# EAGLE schematic MaTouch ESP32-P4 TFT with Touch 7“ V1.2 (EAGLE 6.1)
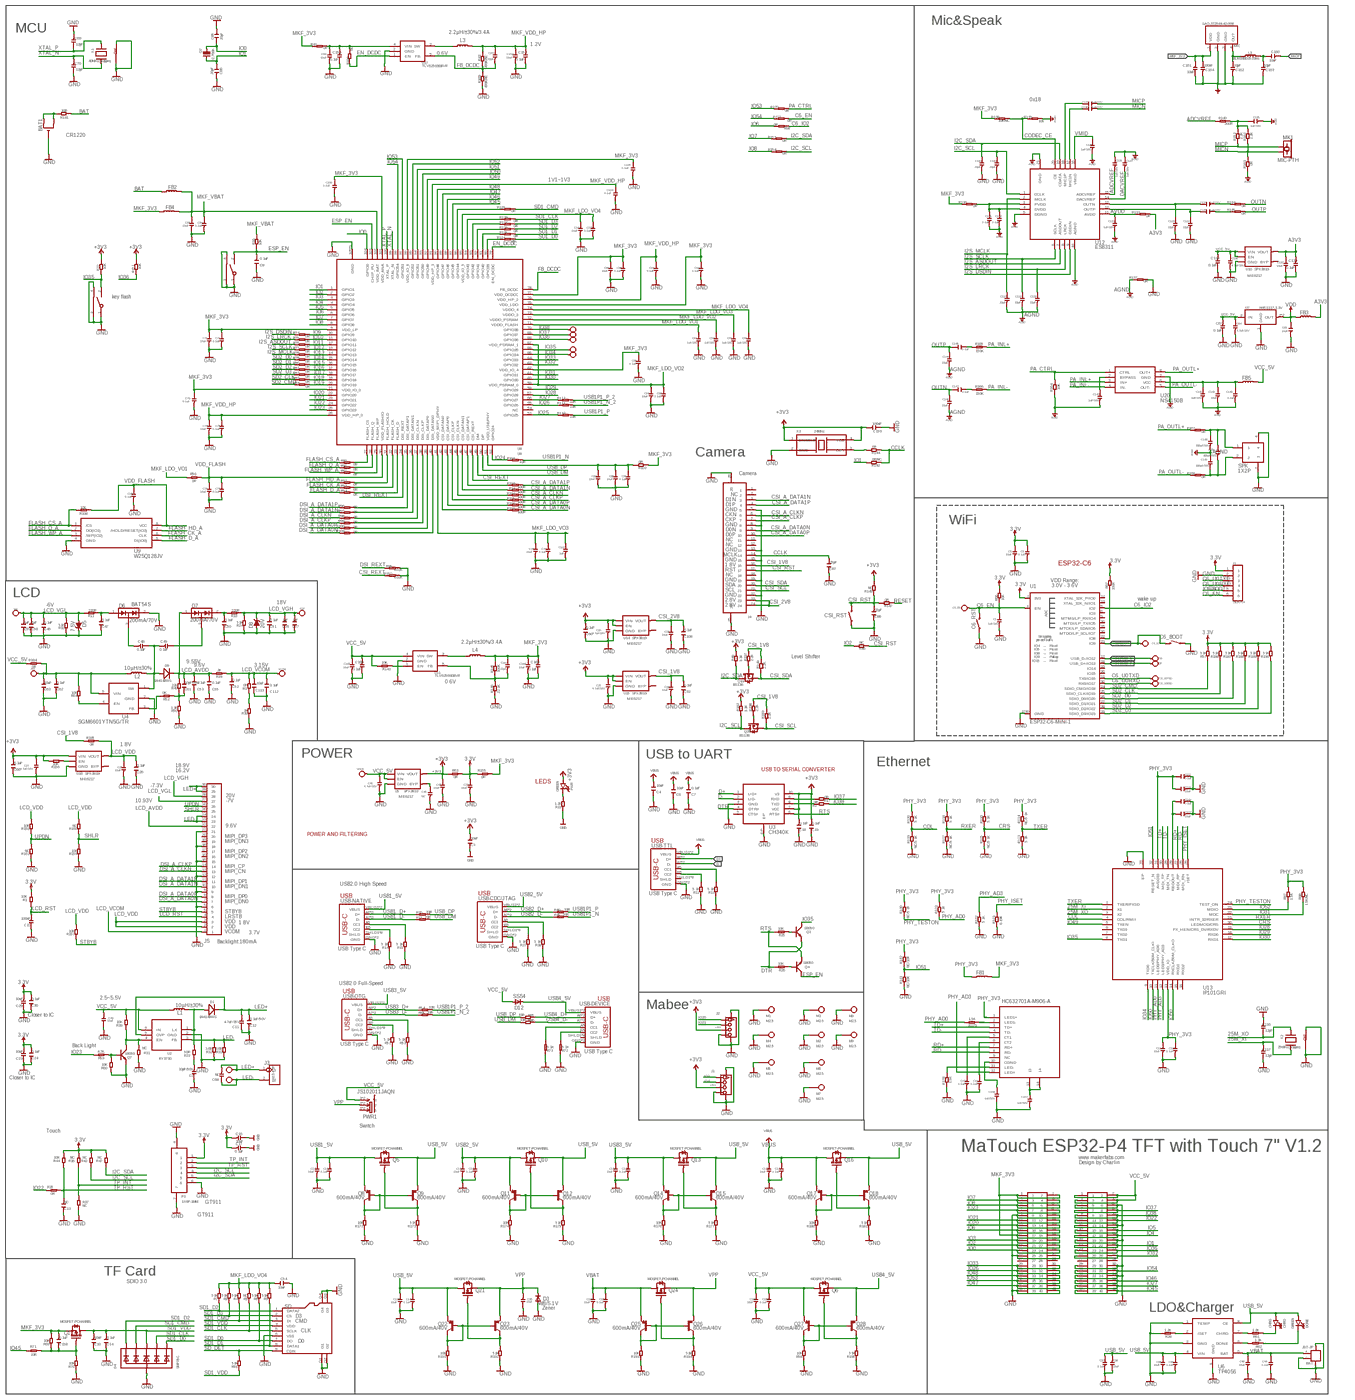
[diagram p0: schematic, sheet 1, overview]
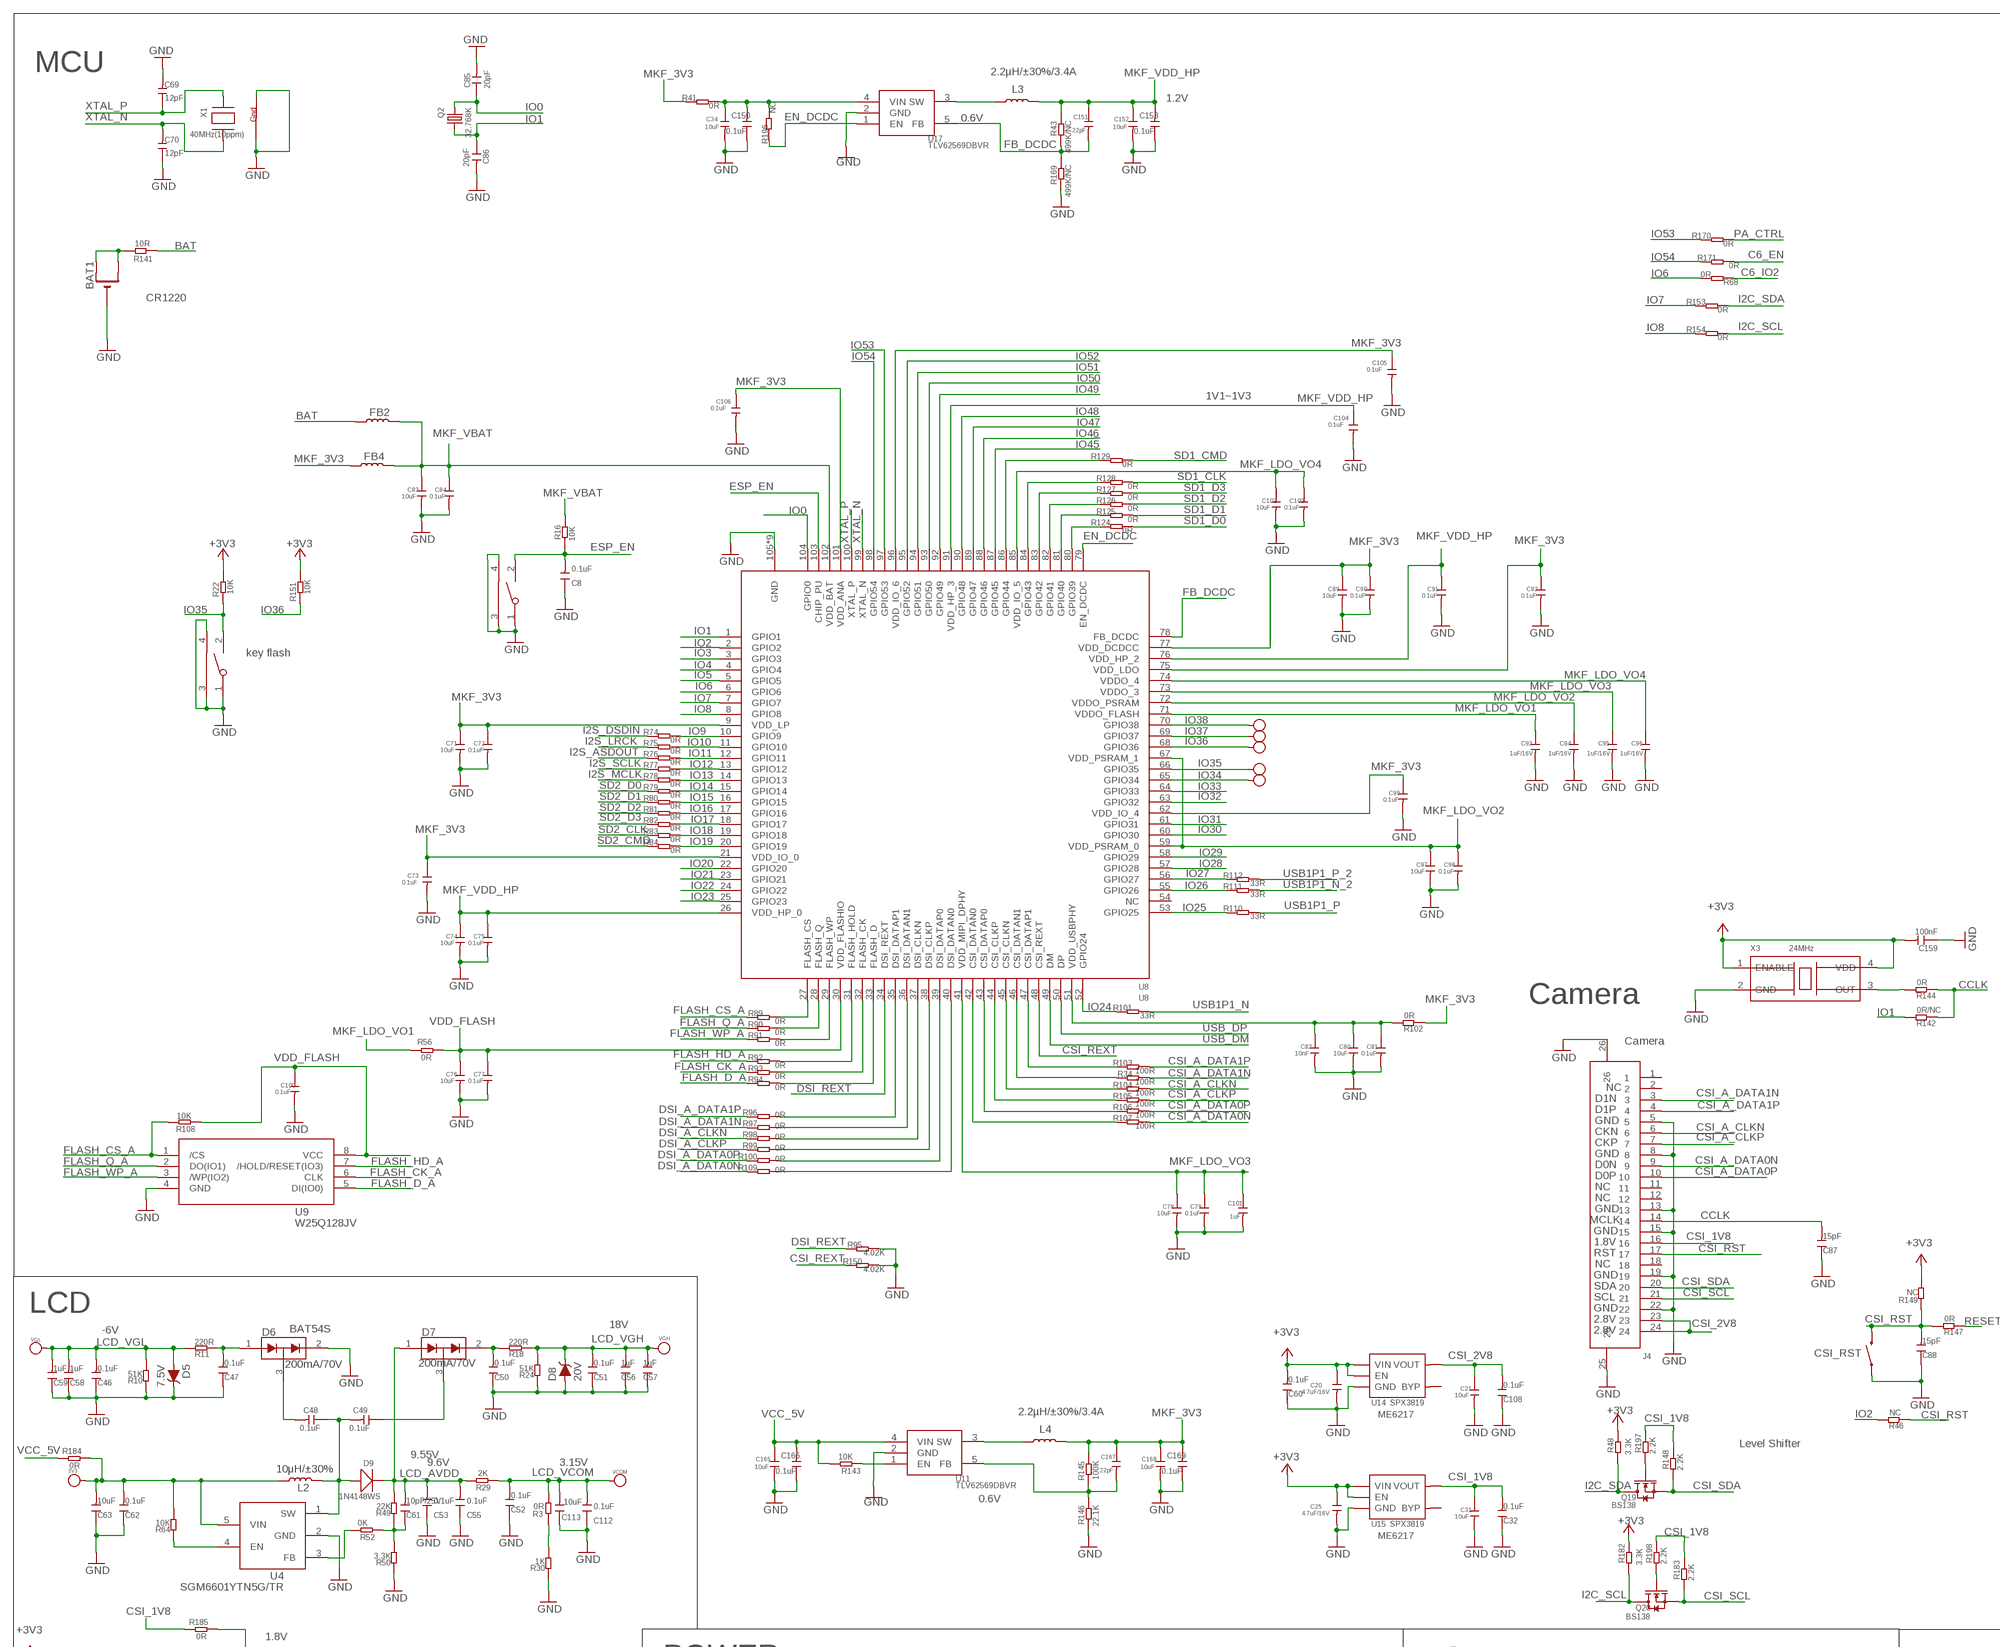
[diagram p1: schematic, sheet 1, part 1 of 4]
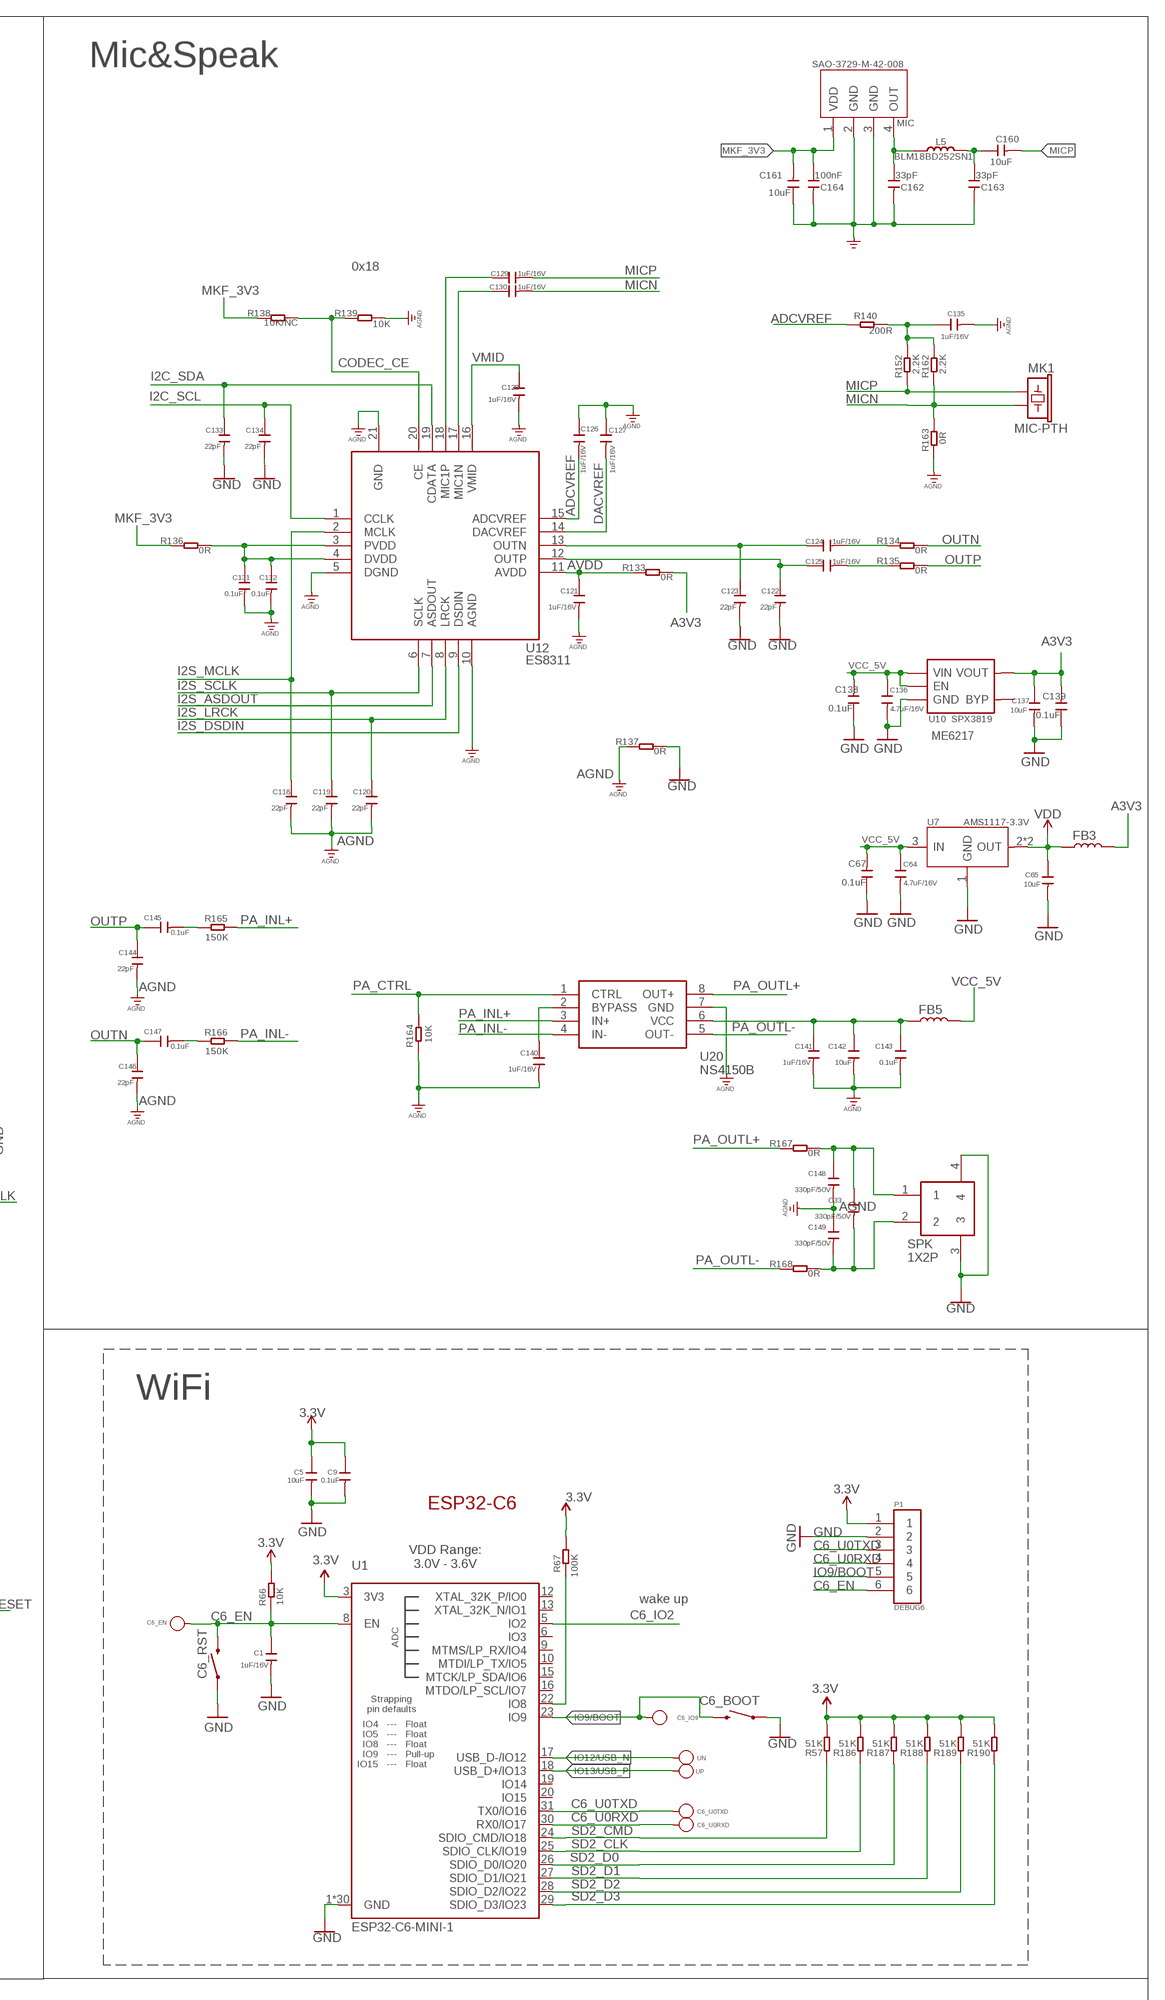
[diagram p2: schematic, sheet 1, part 2 of 4]
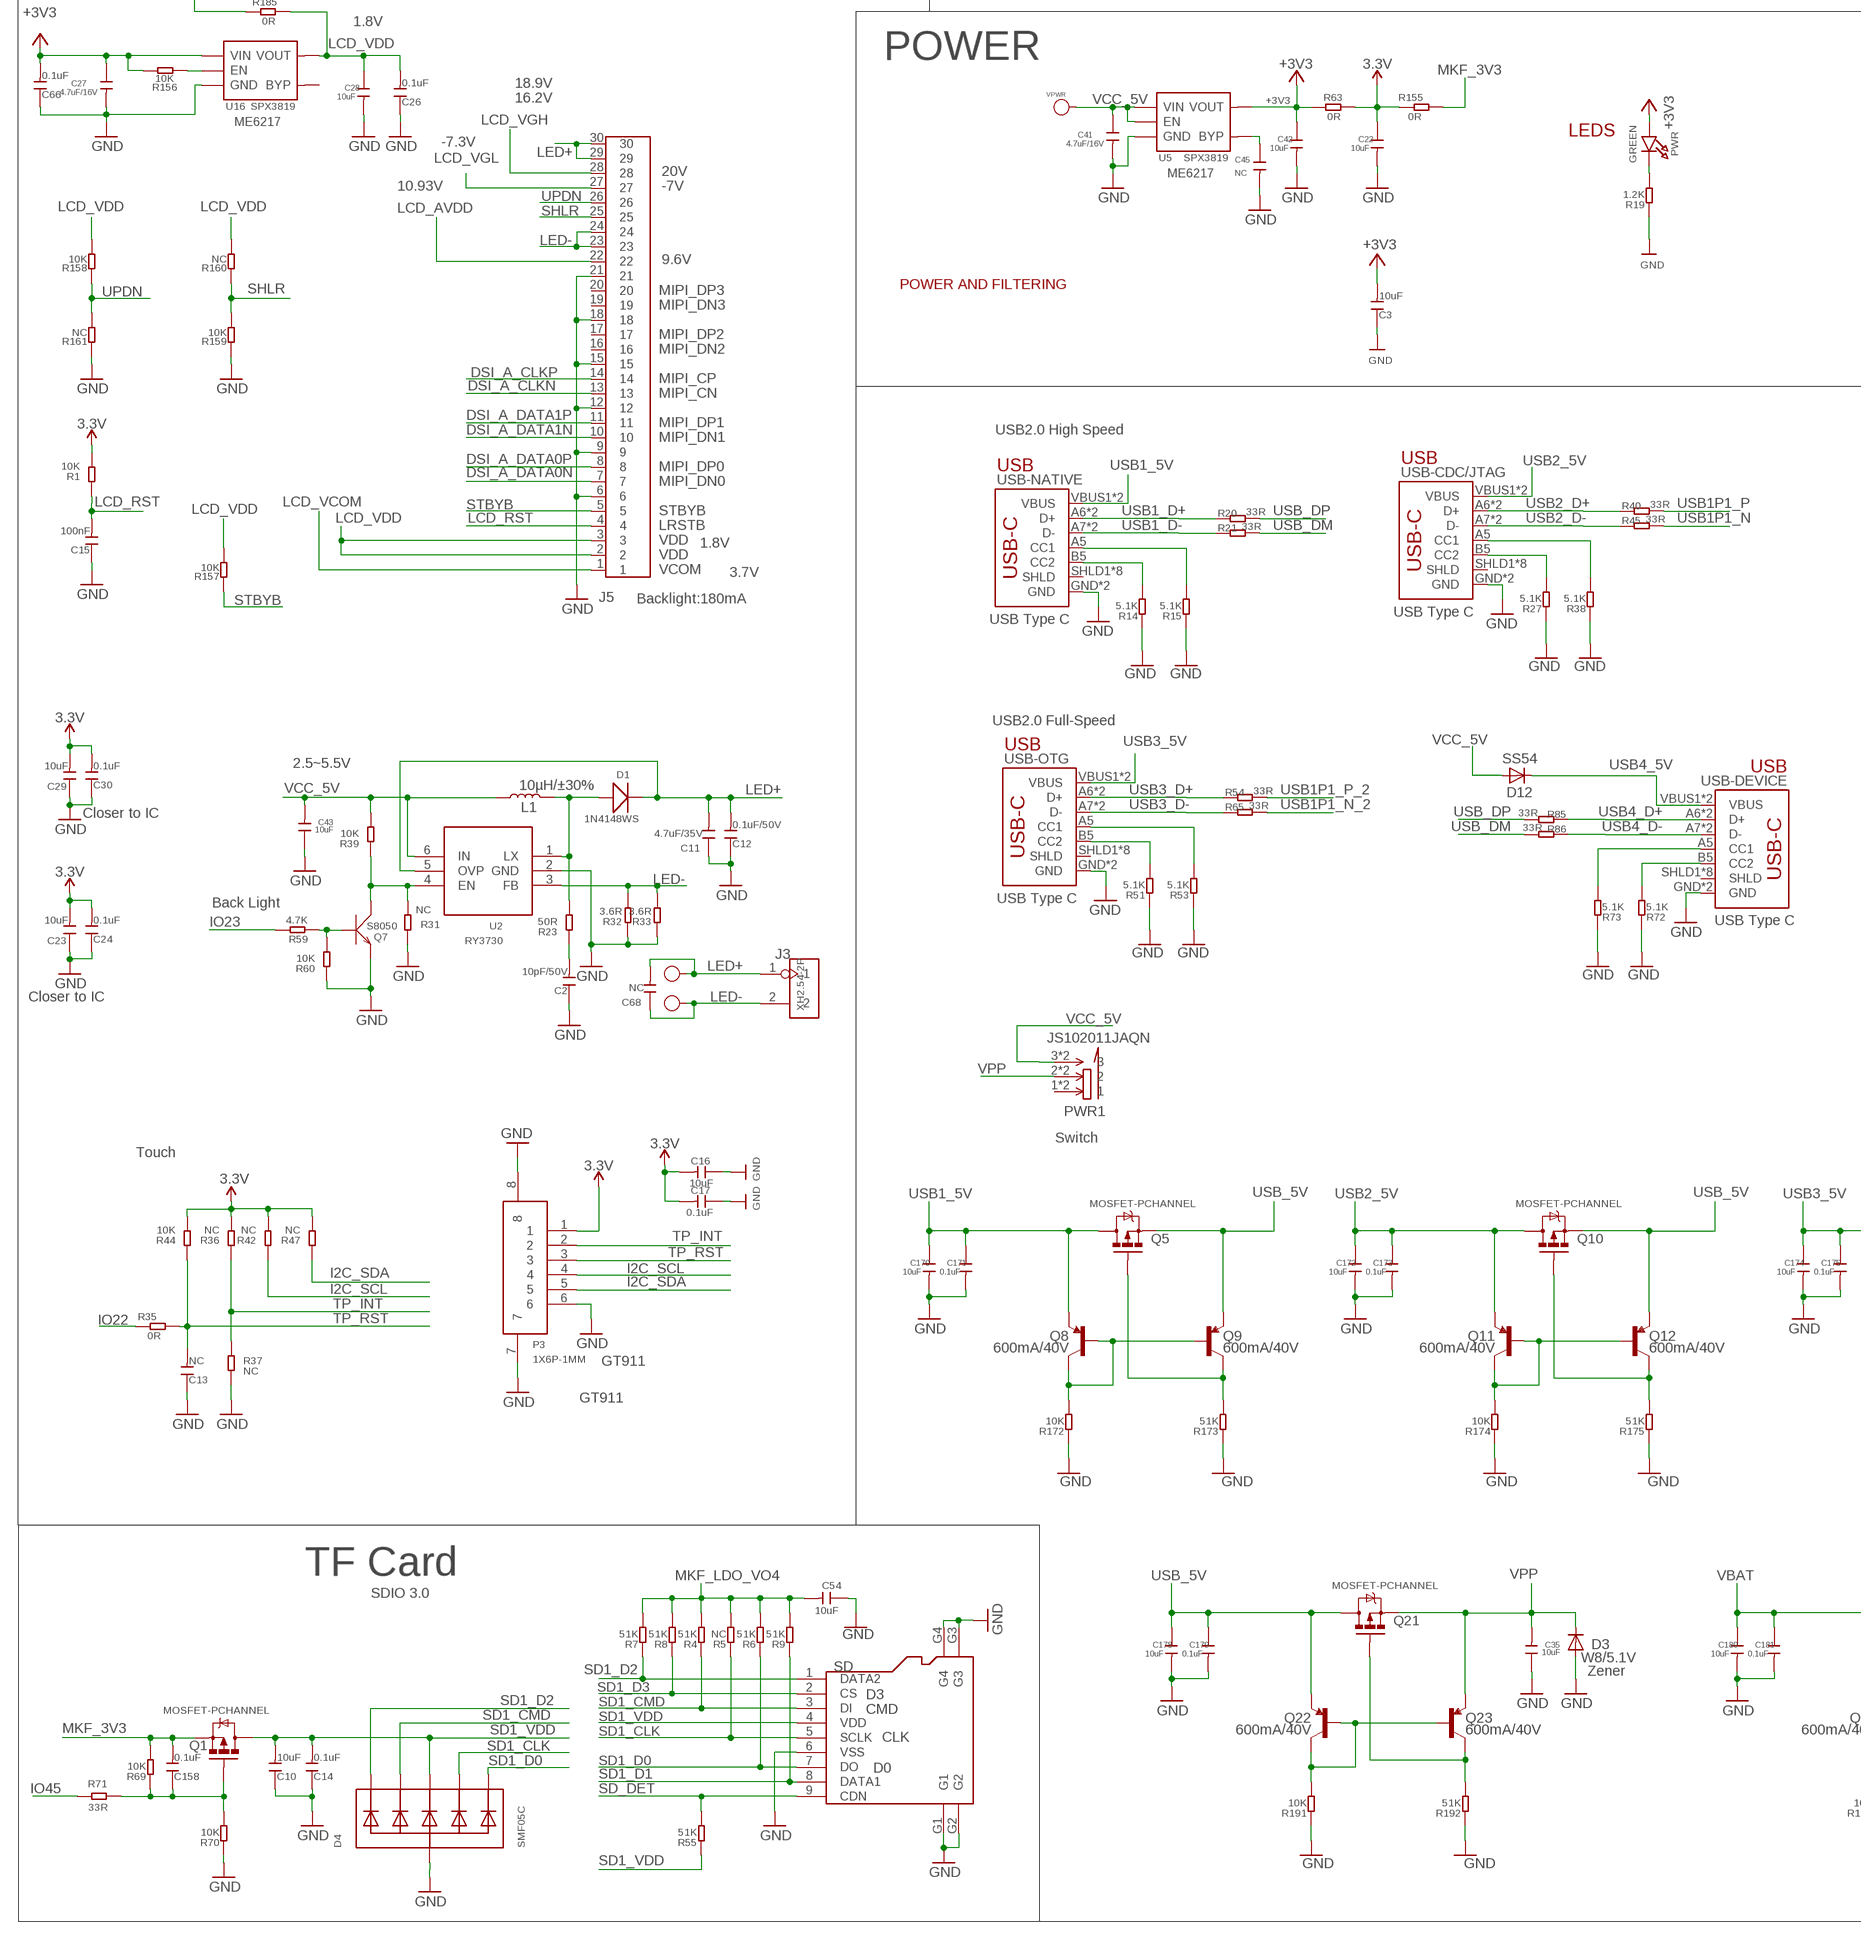
[diagram p3: schematic, sheet 1, part 3 of 4]
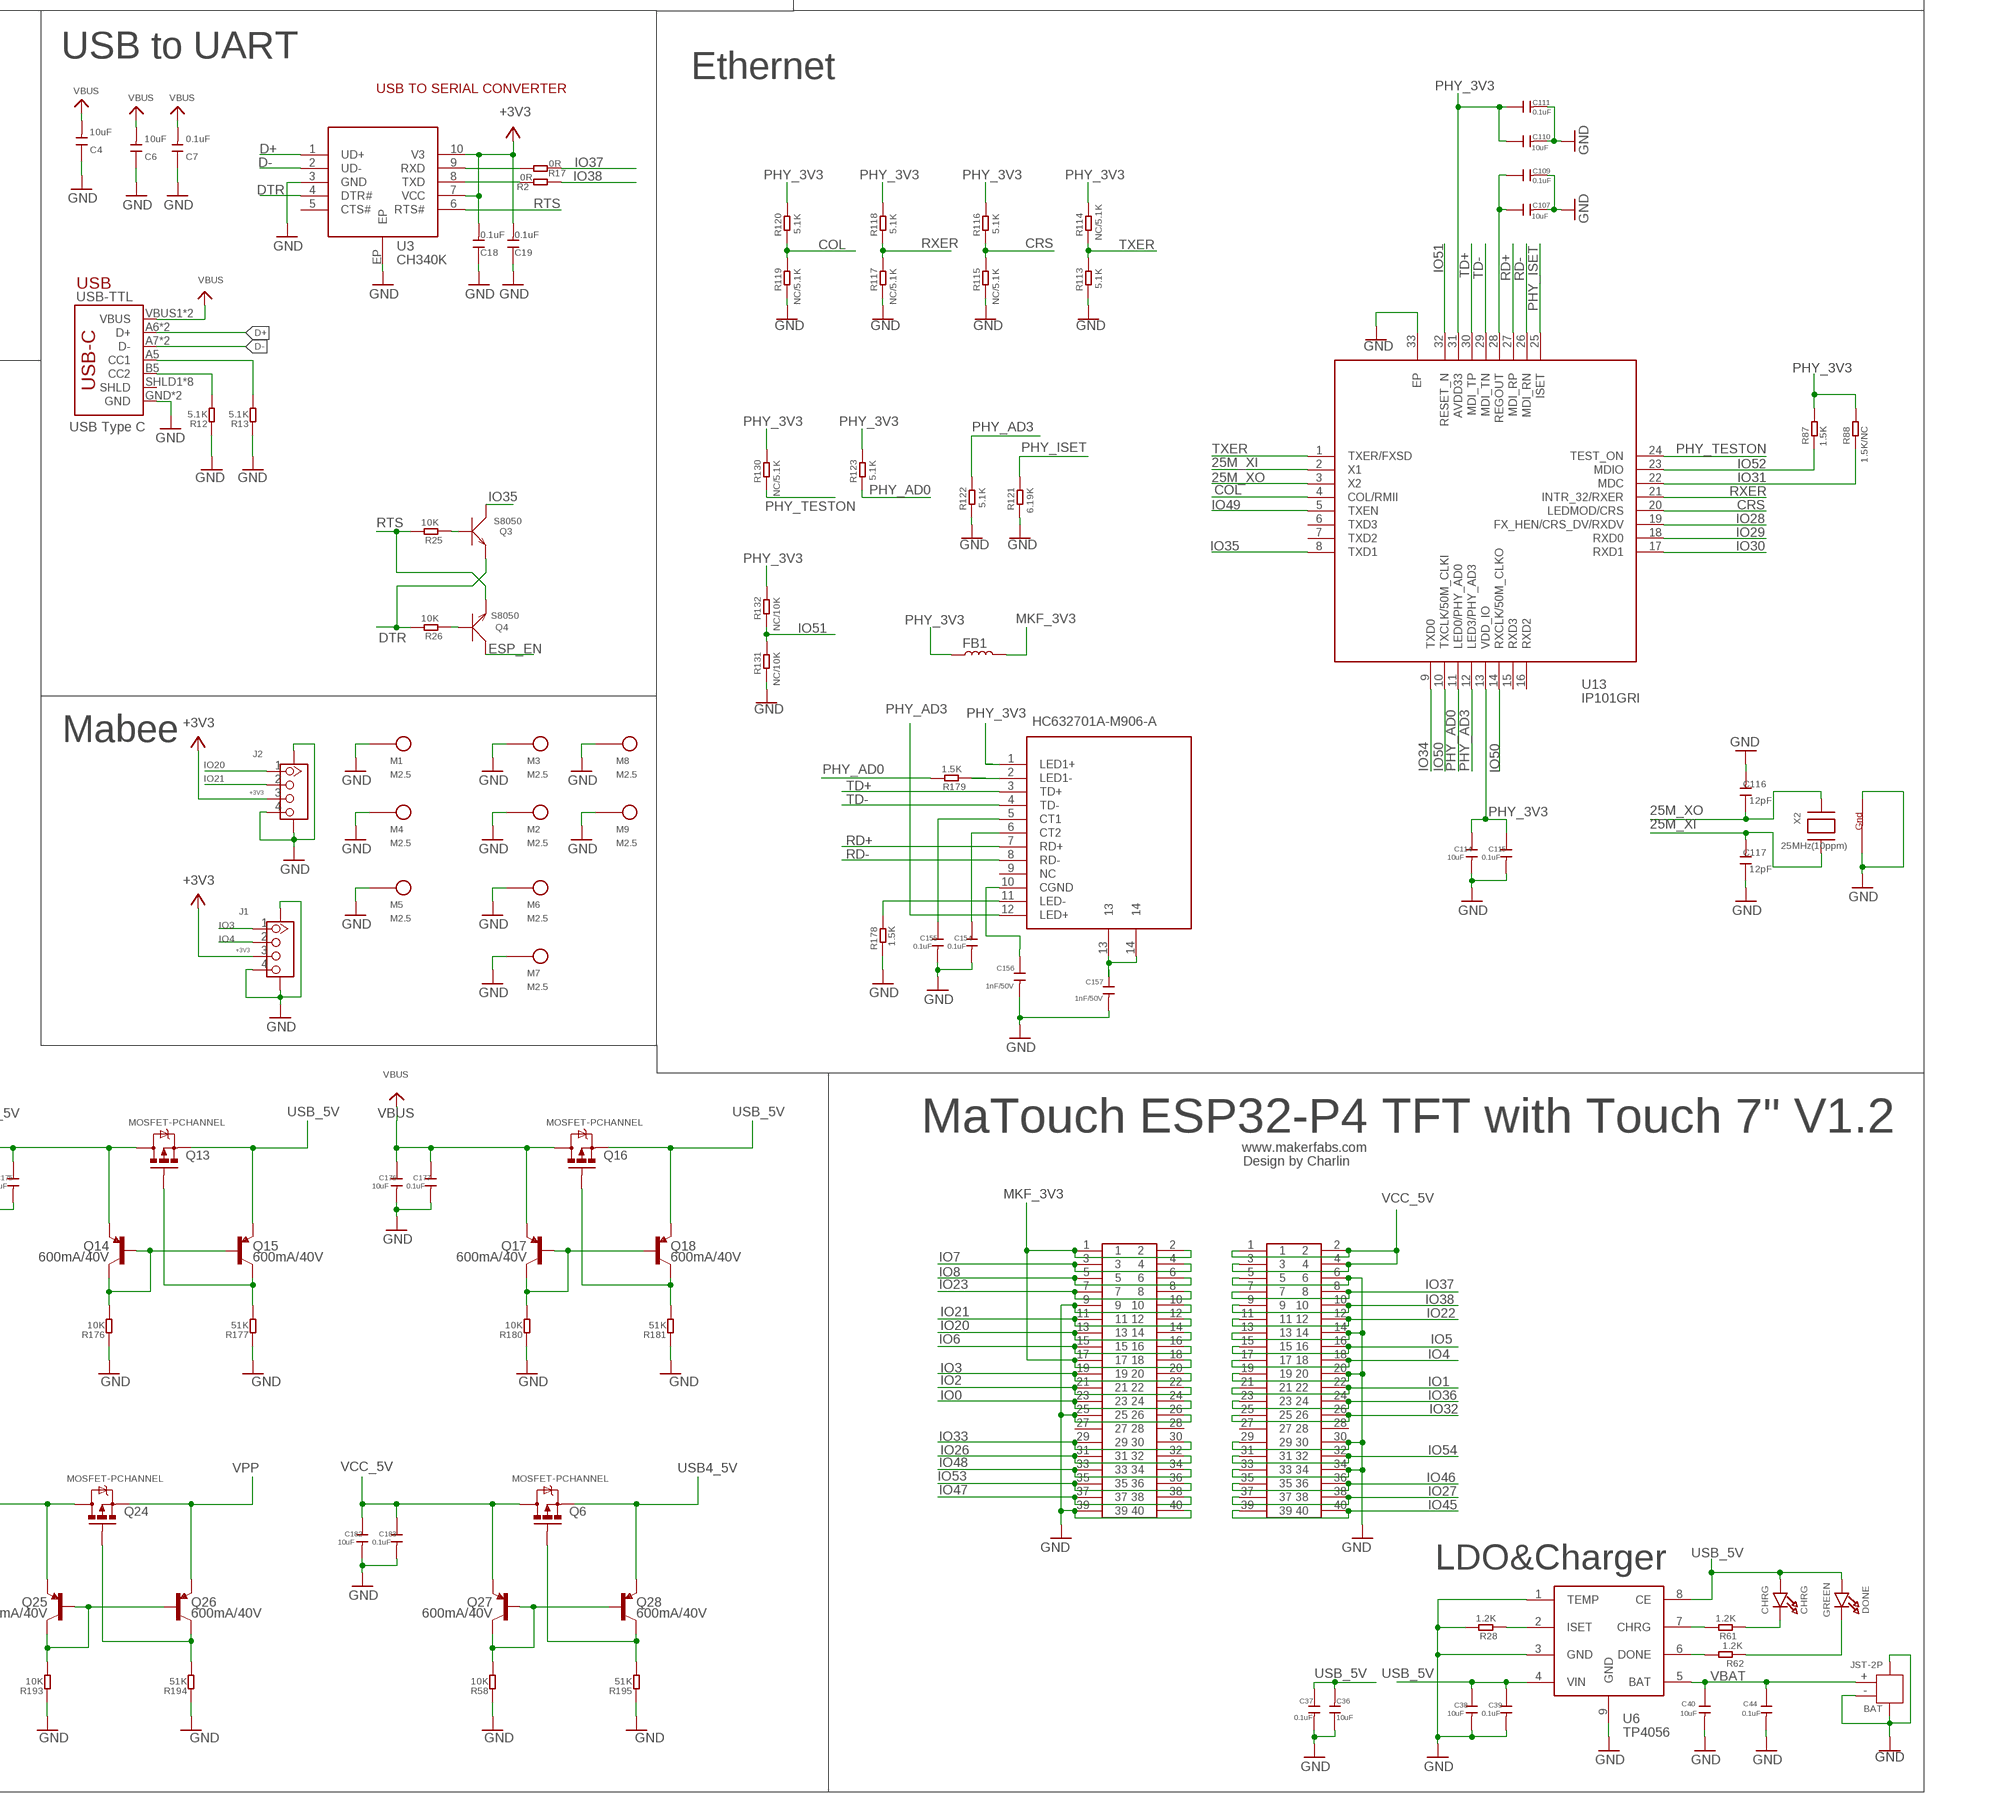
[diagram p4: schematic, sheet 1, part 4 of 4]

## Parts
3V3  PAD-TEST-POINT-CIRCLE'4545'  [TP_4545]
BAT  JST-2P  JST-2P-SMD'2.0'  [HW2-SMD-2.0-90D]
BAT1  CR1220SMT  [CR1220-SMD]
BOOT  TS24CA  [2*4*3.5MM]
C1  1uF/16V  C-0603  [C0603]
C2  10pF/50V  DISCRETE_C-0603  [DISCRETE_C0603]
C3  10uF  DISCRETE_C-0603  [DISCRETE_C0603]
C4  10uF  DISCRETE_C-0603  [DISCRETE_C0603]
C5  10uF  C-0603  [C0603]
C6  10uF  DISCRETE_C-0603  [DISCRETE_C0603]
C6_BOOT  MOMENTARY-SWITCH-SPST-SMD-4.6X2.8MM  [TACTILE_SWITCH_SMD_4.6X2.8MM]
C6_EN  PAD-TEST-POINT-CIRCLE'4545'  [TP_4545]
C6_IO9  PAD-TEST-POINT-CIRCLE'4545'  [TP_4545]
C6_RST  MOMENTARY-SWITCH-SPST-SMD-4.6X2.8MM  [TACTILE_SWITCH_SMD_4.6X2.8MM]
C6_U0RXD  PAD-TEST-POINT-CIRCLE'4545'  [TP_4545]
C6_U0TXD  PAD-TEST-POINT-CIRCLE'4545'  [TP_4545]
C7  0.1uF  DISCRETE_C-0603  [DISCRETE_C0603]
C8  0.1uF  DISCRETE_C-0603  [DISCRETE_C0603]
C9  0.1uF  C-0603  [C0603]
C10  10uF  DISCRETE_C-0603  [DISCRETE_C0603]
C11  4.7uF/35V  DISCRETE_C-1206  [DISCRETE_C1206]
C12  0.1uF/50V  DISCRETE_C-0603  [DISCRETE_C0603]
C13  NC  DISCRETE_C-0603  [DISCRETE_C0603]
C14  0.1uF  DISCRETE_C-0603  [DISCRETE_C0603]
C15  100nF  DISCRETE_C-0603  [DISCRETE_C0603]
C16  10uF  DISCRETE_C-0603  [DISCRETE_C0603]
C17  0.1uF  DISCRETE_C-0603  [DISCRETE_C0603]
C18  0.1uF  DISCRETE_C-0603  [DISCRETE_C0603]
C19  0.1uF  DISCRETE_C-0603  [DISCRETE_C0603]
C20  4.7uF/16V  C-0603  [C0603]
C21  10uF  C-0603  [C0603]
C22  10uF  C-0603  [C0603]
C23  10uF  DISCRETE_C-0603  [DISCRETE_C0603]
C24  0.1uF  DISCRETE_C-0603  [DISCRETE_C0603]
C25  4.7uF/16V  C-0603  [C0603]
C26  0.1uF  DISCRETE_C-0603  [DISCRETE_C0603]
C27  4.7uF/16V  C-0603  [C0603]
C28  10uF  C-0603  [C0603]
C29  10uF  DISCRETE_C-0603  [DISCRETE_C0603]
C30  0.1uF  DISCRETE_C-0603  [DISCRETE_C0603]
C31  10uF  C-0603  [C0603]
C32  0.1uF  DISCRETE_C-0603  [DISCRETE_C0603]
C33  330pF/50V  C-0603  [C0603]
C34  10uF  C-0603  [C0603]
C35  10uF  C-0603  [C0603]
C36  10uF  C-0603  [C0603]
C37  0.1uF  C-0603  [C0603]
C38  10uF  C-0603  [C0603]
C39  0.1uF  C-0603  [C0603]
C40  10uF  C-0603  [C0603]
C41  4.7uF/16V  C-0603  [C0603]
C42  10uF  C-0603  [C0603]
C43  10uF  C-0603  [C0603]
C44  0.1uF  C-0603  [C0603]
C45  NC  C-0603  [C0603]
C46  0.1uF  DISCRETE_C-0603  [DISCRETE_C0603]
C47  0.1uF  DISCRETE_C-0603  [DISCRETE_C0603]
C48  0.1uF  DISCRETE_C-0603  [DISCRETE_C0603]
C49  0.1uF  DISCRETE_C-0603  [DISCRETE_C0603]
C50  0.1uF  DISCRETE_C-0603  [DISCRETE_C0603]
C51  0.1uF  DISCRETE_C-0603  [DISCRETE_C0603]
C52  0.1uF  DISCRETE_C-0603  [DISCRETE_C0603]
C53  0.1uF  DISCRETE_C-0603  [DISCRETE_C0603]
C54  10uF  DISCRETE_C-0603  [DISCRETE_C0603]
C55  0.1uF  DISCRETE_C-0603  [DISCRETE_C0603]
C56  1uF  DISCRETE_C-0603  [DISCRETE_C0603]
C57  1uF  DISCRETE_C-0603  [DISCRETE_C0603]
C58  1uF  DISCRETE_C-0603  [DISCRETE_C0603]
C59  1uF  DISCRETE_C-0603  [DISCRETE_C0603]
C60  0.1uF  DISCRETE_C-0603  [DISCRETE_C0603]
C61  10pF/25V  DISCRETE_C-0603  [DISCRETE_C0603]
C62  0.1uF  DISCRETE_C-0603  [DISCRETE_C0603]
C63  10uF  DISCRETE_C-0603  [DISCRETE_C0603]
C64  4.7uF/16V  C-0603  [C0603]
C65  10uF  C-0603  [C0603]
C66  0.1uF  DISCRETE_C-0603  [DISCRETE_C0603]
C67  0.1uF  C-0603  [C0603]
C68  NC  DISCRETE_C-1206  [DISCRETE_C1206]
C69  12pF  DISCRETE_C-0402  [DISCRETE_C0402]
C70  12pF  DISCRETE_C-0402  [DISCRETE_C0402]
C71  10uF  C-0603  [C0603]
C72  0.1uF  C-0603  [C0603]
C73  0.1uF  C-0603  [C0603]
C74  10uF  C-0603  [C0603]
C75  0.1uF  C-0603  [C0603]
C76  10uF  C-0603  [C0603]
C77  0.1uF  C-0603  [C0603]
C78  10uF  C-0603  [C0603]
C79  0.1uF  C-0603  [C0603]
C80  10uF  C-0603  [C0603]
C81  0.1uF  C-0603  [C0603]
C82  10nF  C-0603  [C0603]
C83  10uF  C-0603  [C0603]
C84  0.1uF  C-0603  [C0603]
C85  20pF  DISCRETE_C-0603  [DISCRETE_C0603]
C86  20pF  DISCRETE_C-0603  [DISCRETE_C0603]
C87  15pF  DISCRETE_C-0603  [DISCRETE_C0603]
C88  15pF  DISCRETE_C-0603  [DISCRETE_C0603]
C89  10uF  C-0603  [C0603]
C90  0.1uF  C-0603  [C0603]
C91  0.1uF  C-0603  [C0603]
C92  0.1uF  C-0603  [C0603]
C93  1uF/16V  C-0603  [C0603]
C94  1uF/16V  C-0603  [C0603]
C95  1uF/16V  C-0603  [C0603]
C96  1uF/16V  C-0603  [C0603]
C97  10uF  C-0603  [C0603]
C98  0.1uF  C-0603  [C0603]
C99  0.1uF  C-0603  [C0603]
C100  0.1uF  C-0603  [C0603]
C101  1uF  C-0603  [C0603]
C102  10uF  C-0603  [C0603]
C103  0.1uF  C-0603  [C0603]
C104  0.1uF  C-0603  [C0603]
C105  0.1uF  C-0603  [C0603]
C106  0.1uF  C-0603  [C0603]
C107  10uF  C-0603  [C0603]
C108  0.1uF  DISCRETE_C-0603  [DISCRETE_C0603]
C109  0.1uF  C-0603  [C0603]
C110  10uF  C-0603  [C0603]
C111  0.1uF  C-0603  [C0603]
C112  0.1uF  DISCRETE_C-0603  [DISCRETE_C0603]
C113  10uF  DISCRETE_C-0603  [DISCRETE_C0603]
C114  10uF  C-0603  [C0603]
C115  0.1uF  C-0603  [C0603]
C116  12pF  DISCRETE_C-0402  [DISCRETE_C0402]
C117  12pF  DISCRETE_C-0402  [DISCRETE_C0402]
C118  22pF  C-0603  [C0603]
C119  22pF  C-0603  [C0603]
C120  22pF  C-0603  [C0603]
C121  1uF/16V  C-0603  [C0603]
C122  22pF  C-0603  [C0603]
C123  22pF  C-0603  [C0603]
C124  1uF/16V  C-0603  [C0603]
C125  1uF/16V  C-0603  [C0603]
C126  1uF/16V  C-0603  [C0603]
C127  1uF/16V  C-0603  [C0603]
C128  1uF/16V  C-0603  [C0603]
C129  1uF/16V  C-0603  [C0603]
C130  1uF/16V  C-0603  [C0603]
C131  0.1uF  C-0603  [C0603]
C132  0.1uF  C-0603  [C0603]
C133  22pF  C-0603  [C0603]
C134  22pF  C-0603  [C0603]
C135  1uF/16V  C-0603  [C0603]
C136  4.7uF/16V  C-0603  [C0603]
C137  10uF  C-0603  [C0603]
C138  0.1uF  C-0603  [C0603]
C139  0.1uF  C-0603  [C0603]
C140  1uF/16V  C-0603  [C0603]
C141  1uF/16V  C-0603  [C0603]
C142  10uF  C-0603  [C0603]
C143  0.1uF  C-0603  [C0603]
C144  22pF  C-0603  [C0603]
C145  0.1uF  C-0603  [C0603]
C146  22pF  C-0603  [C0603]
C147  0.1uF  C-0603  [C0603]
C148  330pF/50V  C-0603  [C0603]
C149  330pF/50V  C-0603  [C0603]
C150  0.1uF  C-0603  [C0603]
C151  22pF  C-0603  [C0603]
C152  10uF  C-0603  [C0603]
C153  0.1uF  C-0603  [C0603]
C154  0.1uF  C-0603  [C0603]
C155  0.1uF  C-0603  [C0603]
C156  1nF/50V  C-0603  [C0603]
C157  1nF/50V  C-0603  [C0603]
C158  0.1uF  DISCRETE_C-0603  [DISCRETE_C0603]
C159  100nF  CAP-0402  [C0402]
C160  10uF  CAP-0603  [C0603]
C161  10uF  CAP-0603  [C0603]
C162  33pF  CAP-0603  [C0603]
C163  33pF  CAP-0603  [C0603]
C164  100nF  CAP-0603  [C0603]
C165  10uF  C-0603  [C0603]
C166  0.1uF  C-0603  [C0603]
C167  22pF  C-0603  [C0603]
C168  10uF  C-0603  [C0603]
C169  0.1uF  C-0603  [C0603]
C170  10uF  C-0603  [C0603]
C171  0.1uF  C-0603  [C0603]
C172  10uF  C-0603  [C0603]
C173  0.1uF  C-0603  [C0603]
C174  10uF  C-0603  [C0603]
C175  0.1uF  C-0603  [C0603]
C176  10uF  C-0603  [C0603]
C177  0.1uF  C-0603  [C0603]
C178  10uF  C-0603  [C0603]
C179  0.1uF  C-0603  [C0603]
C180  10uF  C-0603  [C0603]
C181  0.1uF  C-0603  [C0603]
C182  10uF  C-0603  [C0603]
C183  0.1uF  C-0603  [C0603]
CHRG  CHRG  LED0805_NOOUTLINE  [CHIPLED_0805_NOOUTLINE]
CSI_RST  MOMENTARY-SWITCH-SPST-SMD-4.6X2.8MM  [TACTILE_SWITCH_SMD_4.6X2.8MM]
D1  1N4148WS  D'0805'  [SOD323]
D3  W8/5.1V  DIODE-SOD123  [SOD123]
D4  SMF05C  TVSARRAY_5LANE  [SOT363]
D5  7.5V  DIODE-ZENER-MMSZ5232BS  [SOD-323]
D6  200mA/70V  BAV99  [SOT23-3]
D7  200mA/70V  BAV99  [SOT23-3]
D8  20V  DIODE-ZENER-MMSZ5232BS  [SOD-323]
D9  1N4148WS  D'0805'  [SOD323]
D12  SS54  DIODE-DO-214AC  [DO-214AC]
D+  TEST-POINT'4545'  [TP-D45MIL]
D-  TEST-POINT'4545'  [TP-D45MIL]
DONE  GREEN  LED0805_NOOUTLINE  [CHIPLED_0805_NOOUTLINE]
FB1  INDUCTORFB-30OHM  [0603]
FB2  INDUCTORFB-30OHM  [0603]
FB3  INDUCTORFB-30OHM  [0603]
FB4  INDUCTORFB-30OHM  [0603]
FB5  INDUCTORFB-30OHM  [0603]
IO34  TEST-POINT'4545'  [TP-D45MIL]
IO35  TEST-POINT'4545'  [TP-D45MIL]
IO36  TEST-POINT'4545'  [TP-D45MIL]
IO37  TEST-POINT'4545'  [TP-D45MIL]
IO38  TEST-POINT'4545'  [TP-D45MIL]
J1  GROVE-CONNECTOR-SMD'90D'  [HW4-SMD-2.0-90D]
J2  GROVE-CONNECTOR-SMD'90D'  [HW4-SMD-2.0-90D]
J3  XH2.54-2P  [XH2.54-2P]
J4  FPC-24P  [SMD26-50P-1760L450W]
J5  FPC-SOCKET-0.5-30P  [30P-0.5-90D-18.4X5.0]
J6  CON2X20-254P-A  [SMD2X20-254P-5080L750W920H]
J7  HR961160C  [HR961160C]
J10  CON2X20-254P-A  [SMD2X20-254P-5080L750W920H]
L1  10µH/±30%  INDUCTOR-CR54-3.3UH  [CR54]
L2  10µH/±30%  INDUCTOR-CR54-3.3UH  [CR54]
L3  2.2µH/±30%/3.4A  INDUCTOR-CR54-3.3UH  [CR54]
L4  2.2µH/±30%/3.4A  INDUCTOR-CR54-3.3UH  [CR54]
L5  BLM18BD252SN1  INDUCTOR/FERRITE-BEAD'0603'  [L0603]
M1  M2.5  [M2.5]
M2  M2.5  [M2.5]
M3  M2.5  [M2.5]
M4  M2.5  [M2.5]
M5  M2.5  [M2.5]
M6  M2.5  [M2.5]
M7  M2.5  [M2.5]
M8  M2.5  [M2.5]
M9  M2.5  [M2.5]
MIC  SAO-3729-M-42-008  MIC-MSM421A3729H8-C  [MIC4-SMD-3.76X2.95MM]
MK1  MIC-PTH  [MICROPHONE-PTH-9.7MM]
P1  DEBUG6  [DEBUG*6]
P3  1X6P-1MM  [1*6P-SMT1MM]
PWR  GREEN  LED0805_NOOUTLINE  [CHIPLED_0805_NOOUTLINE]
PWR1  JS102011JAQN  [SMD-6-2.5MM]
Q1  MOSFET-PCHANNEL  [SOT23-3]
Q2  32.768K  CRYSTAL_3215  [XTAL3215]
Q3  S8050  TRANSISTOR-NPN-SOT23  [SOT23]
Q4  S8050  TRANSISTOR-NPN-SOT23  [SOT23]
Q5  MOSFET-PCHANNEL  [SOT23-3]
Q6  MOSFET-PCHANNEL  [SOT23-3]
Q7  S8050  TRANSISTOR-NPN-SOT23  [SOT23]
Q8  600mA/40V  TRANS_PNP-MMBT4403  [SOT23-3]
Q9  600mA/40V  TRANS_PNP-MMBT4403  [SOT23-3]
Q10  MOSFET-PCHANNEL  [SOT23-3]
Q11  600mA/40V  TRANS_PNP-MMBT4403  [SOT23-3]
Q12  600mA/40V  TRANS_PNP-MMBT4403  [SOT23-3]
Q13  MOSFET-PCHANNEL  [SOT23-3]
Q14  600mA/40V  TRANS_PNP-MMBT4403  [SOT23-3]
Q15  600mA/40V  TRANS_PNP-MMBT4403  [SOT23-3]
Q16  MOSFET-PCHANNEL  [SOT23-3]
Q17  600mA/40V  TRANS_PNP-MMBT4403  [SOT23-3]
Q18  600mA/40V  TRANS_PNP-MMBT4403  [SOT23-3]
Q19  BS138  MOSFET-N'SOT23'  [SOT23]
Q20  BS138  MOSFET-N'SOT23'  [SOT23]
Q21  MOSFET-PCHANNEL  [SOT23-3]
Q22  600mA/40V  TRANS_PNP-MMBT4403  [SOT23-3]
Q23  600mA/40V  TRANS_PNP-MMBT4403  [SOT23-3]
Q24  MOSFET-PCHANNEL  [SOT23-3]
Q25  600mA/40V  TRANS_PNP-MMBT4403  [SOT23-3]
Q26  600mA/40V  TRANS_PNP-MMBT4403  [SOT23-3]
Q27  600mA/40V  TRANS_PNP-MMBT4403  [SOT23-3]
Q28  600mA/40V  TRANS_PNP-MMBT4403  [SOT23-3]
R1  10K  DISCRETE_R-0603  [DISCRETE_R0603]
R2  0R  R-0603  [R0603]
R3  0R  DISCRETE_R-0603  [DISCRETE_R0603]
R4  51K  DISCRETE_R-0603  [DISCRETE_R0603]
R5  NC  DISCRETE_R-0603  [DISCRETE_R0603]
R6  51K  DISCRETE_R-0603  [DISCRETE_R0603]
R7  51K  DISCRETE_R-0603  [DISCRETE_R0603]
R8  51K  DISCRETE_R-0603  [DISCRETE_R0603]
R9  51K  DISCRETE_R-0603  [DISCRETE_R0603]
R10  51K  DISCRETE_R-0603  [DISCRETE_R0603]
R11  220R  DISCRETE_R-0603  [DISCRETE_R0603]
R12  5.1K  DISCRETE_R-0603  [DISCRETE_R0603]
R13  5.1K  DISCRETE_R-0603  [DISCRETE_R0603]
R14  5.1K  DISCRETE_R-0603  [DISCRETE_R0603]
R15  5.1K  DISCRETE_R-0603  [DISCRETE_R0603]
R16  10K  R-0603  [R0603]
R17  0R  R-0603  [R0603]
R18  220R  DISCRETE_R-0603  [DISCRETE_R0603]
R19  1.2K  DISCRETE_R-0603  [DISCRETE_R0603]
R20  33R  R-0603  [R0603]
R21  33R  R-0603  [R0603]
R22  10K  R-0603  [R0603]
R23  50R  DISCRETE_R-0603  [DISCRETE_R0603]
R24  51K  DISCRETE_R-0603  [DISCRETE_R0603]
R25  10K  R-0603  [R0603]
R26  10K  R-0603  [R0603]
R27  5.1K  DISCRETE_R-0603  [DISCRETE_R0603]
R28  1.2K  R-0603  [R0603]
R29  2K  DISCRETE_R-0603  [DISCRETE_R0603]
R30  1K  DISCRETE_R-0603  [DISCRETE_R0603]
R31  NC  DISCRETE_R-0603  [DISCRETE_R0603]
R32  3.6R  DISCRETE_R-0603  [DISCRETE_R0603]
R33  3.6R  DISCRETE_R-0603  [DISCRETE_R0603]
R34  100R  R-0603  [R0603]
R35  0R  R-0603  [R0603]
R36  NC  DISCRETE_R-0603  [DISCRETE_R0603]
R37  NC  DISCRETE_R-0603  [DISCRETE_R0603]
R38  5.1K  DISCRETE_R-0603  [DISCRETE_R0603]
R39  10K  DISCRETE_R-0603  [DISCRETE_R0603]
R40  33R  R-0603  [R0603]
R41  0R  R-0603  [R0603]
R42  NC  DISCRETE_R-0603  [DISCRETE_R0603]
R43  499K/NC  R-0603  [R0603]
R44  10K  DISCRETE_R-0603  [DISCRETE_R0603]
R45  33R  R-0603  [R0603]
R46  NC  R-0603  [R0603]
R47  NC  DISCRETE_R-0603  [DISCRETE_R0603]
R48  3.3K  R-0603  [R0603]
R49  22K  DISCRETE_R-0603  [DISCRETE_R0603]
R50  3.3K  DISCRETE_R-0603  [DISCRETE_R0603]
R51  5.1K  DISCRETE_R-0603  [DISCRETE_R0603]
R52  0K  DISCRETE_R-0603  [DISCRETE_R0603]
R53  5.1K  DISCRETE_R-0603  [DISCRETE_R0603]
R54  33R  R-0603  [R0603]
R55  51K  DISCRETE_R-0603  [DISCRETE_R0603]
R56  0R  R-0603  [R0603]
R57  51K  DISCRETE_R-0603  [DISCRETE_R0603]
R58  10K  DISCRETE_R-0603  [DISCRETE_R0603]
R59  4.7K  DISCRETE_R-0603  [DISCRETE_R0603]
R60  10K  DISCRETE_R-0603  [DISCRETE_R0603]
R61  1.2K  R-0603  [R0603]
R62  1.2K  R-0603  [R0603]
R63  0R  R-0603  [R0603]
R64  10K  DISCRETE_R-0603  [DISCRETE_R0603]
R65  33R  R-0603  [R0603]
R66  10K  R-0603  [R0603]
R67  100K  R-0603  [R0603]
R68  0R  R-0603  [R0603]
R69  10K  DISCRETE_R-0603  [DISCRETE_R0603]
R70  10K  DISCRETE_R-0603  [DISCRETE_R0603]
R71  33R  R-0603  [R0603]
R72  5.1K  DISCRETE_R-0603  [DISCRETE_R0603]
R73  5.1K  DISCRETE_R-0603  [DISCRETE_R0603]
R74  0R  R-0603  [R0603]
R75  0R  R-0603  [R0603]
R76  0R  R-0603  [R0603]
R77  0R  R-0603  [R0603]
R78  0R  R-0603  [R0603]
R79  0R  R-0603  [R0603]
R80  0R  R-0603  [R0603]
R81  0R  R-0603  [R0603]
R82  0R  R-0603  [R0603]
R83  0R  R-0603  [R0603]
R84  0R  R-0603  [R0603]
R85  33R  R-0603  [R0603]
R86  33R  R-0603  [R0603]
R87  1.5K  R-0603  [R0603]
R88  1.5K/NC  R-0603  [R0603]
R89  0R  R-0603  [R0603]
R90  0R  R-0603  [R0603]
R91  0R  R-0603  [R0603]
R92  0R  R-0603  [R0603]
R93  0R  R-0603  [R0603]
R94  0R  R-0603  [R0603]
R95  4.02K  R-0603  [R0603]
R96  0R  R-0603  [R0603]
R97  0R  R-0603  [R0603]
R98  0R  R-0603  [R0603]
R99  0R  R-0603  [R0603]
R100  0R  R-0603  [R0603]
R101  33R  R-0603  [R0603]
R102  0R  R-0603  [R0603]
R103  100R  R-0603  [R0603]
R104  100R  R-0603  [R0603]
R105  100R  R-0603  [R0603]
R106  100R  R-0603  [R0603]
R107  100R  R-0603  [R0603]
R108  10K  DISCRETE_R-0603  [DISCRETE_R0603]
R109  0R  R-0603  [R0603]
R110  33R  R-0603  [R0603]
R111  33R  R-0603  [R0603]
R112  33R  R-0603  [R0603]
R113  5.1K  R-0603  [R0603]
R114  NC/5.1K  R-0603  [R0603]
R115  NC/5.1K  R-0603  [R0603]
R116  5.1K  R-0603  [R0603]
R117  NC/5.1K  R-0603  [R0603]
R118  5.1K  R-0603  [R0603]
R119  NC/5.1K  R-0603  [R0603]
R120  5.1K  R-0603  [R0603]
R121  6.19K  R-0603  [R0603]
R122  5.1K  R-0603  [R0603]
R123  5.1K  R-0603  [R0603]
R124  0R  R-0603  [R0603]
R125  0R  R-0603  [R0603]
R126  0R  R-0603  [R0603]
R127  0R  R-0603  [R0603]
R128  0R  R-0603  [R0603]
R129  0R  R-0603  [R0603]
R130  NC/5.1K  R-0603  [R0603]
R131  NC/10K  R-0603  [R0603]
R132  NC/10K  R-0603  [R0603]
R133  0R  R-0603  [R0603]
R134  0R  R-0603  [R0603]
R135  0R  R-0603  [R0603]
R136  0R  R-0603  [R0603]
R137  0R  R-0603  [R0603]
R138  10K/NC  R-0603  [R0603]
R139  10K  R-0603  [R0603]
R140  200R  R-0603  [R0603]
R141  10R  R-0603  [R0603]
R142  0R/NC  R-0603  [R0603]
R143  10K  R-0603  [R0603]
R144  0R  R-0603  [R0603]
R145  100K  R-0603  [R0603]
R146  22.1K  R-0603  [R0603]
R147  0R  R-0603  [R0603]
R148  2.2K  R-0603  [R0603]
R149  NC  DISCRETE_R-0603  [DISCRETE_R0603]
R150  4.02K  R-0603  [R0603]
R151  10K  R-0603  [R0603]
R152  2.2K  R-0603  [R0603]
R153  0R  R-0603  [R0603]
R154  0R  R-0603  [R0603]
R155  0R  R-0603  [R0603]
R156  10K  DISCRETE_R-0603  [DISCRETE_R0603]
R157  10K  DISCRETE_R-0603  [DISCRETE_R0603]
R158  10K  DISCRETE_R-0603  [DISCRETE_R0603]
R159  10K  DISCRETE_R-0603  [DISCRETE_R0603]
R160  NC  DISCRETE_R-0603  [DISCRETE_R0603]
R161  NC  DISCRETE_R-0603  [DISCRETE_R0603]
R162  2.2K  R-0603  [R0603]
R163  0R  R-0603  [R0603]
R164  10K  R-0603  [R0603]
R165  150K  R-0603  [R0603]
R166  150K  R-0603  [R0603]
R167  0R  R-0603  [R0603]
R168  0R  R-0603  [R0603]
R169  499K/NC  R-0603  [R0603]
R170  0R  R-0603  [R0603]
R171  0R  R-0603  [R0603]
R172  10K  DISCRETE_R-0603  [DISCRETE_R0603]
R173  51K  DISCRETE_R-0603  [DISCRETE_R0603]
R174  10K  DISCRETE_R-0603  [DISCRETE_R0603]
R175  51K  DISCRETE_R-0603  [DISCRETE_R0603]
R176  10K  DISCRETE_R-0603  [DISCRETE_R0603]
R177  51K  DISCRETE_R-0603  [DISCRETE_R0603]
R178  1.5K  R-0603  [R0603]
R179  1.5K  R-0603  [R0603]
R180  10K  DISCRETE_R-0603  [DISCRETE_R0603]
R181  51K  DISCRETE_R-0603  [DISCRETE_R0603]
R182  3.3K  R-0603  [R0603]
R183  2.2K  R-0603  [R0603]
R184  0R  R-0603  [R0603]
R185  0R  R-0603  [R0603]
R186  51K  DISCRETE_R-0603  [DISCRETE_R0603]
R187  51K  DISCRETE_R-0603  [DISCRETE_R0603]
R188  51K  DISCRETE_R-0603  [DISCRETE_R0603]
R189  51K  DISCRETE_R-0603  [DISCRETE_R0603]
R190  51K  DISCRETE_R-0603  [DISCRETE_R0603]
R191  10K  DISCRETE_R-0603  [DISCRETE_R0603]
R192  51K  DISCRETE_R-0603  [DISCRETE_R0603]
R193  10K  DISCRETE_R-0603  [DISCRETE_R0603]
R194  51K  DISCRETE_R-0603  [DISCRETE_R0603]
R195  51K  DISCRETE_R-0603  [DISCRETE_R0603]
R196  NC  R-0603  [R0603]
R197  2.2K  R-0603  [R0603]
R198  2.2K  R-0603  [R0603]
RST  TS24CA  [2*4*3.5MM]
SD  HOLDER-MICROSD-9P  [9P-SMD-W/-RING]
SPK  1X2P  [1X2P-SMT1.25MM]
U1  ESP32-C6-MINI-1  [ESP32-C6-MINI-1]
U2  RY3730  [SOT23-6]
U3  CH340K  [ESOP-10-EP-150MIL]
U4  SGM6601YTN5G/TR  [SOT-23-5]
U5  SPX3819  [SOT23-5]
U6  TP4056  [SOP8-1.27P]
U7  AMS1117-3.3V  LD1117'SOT89'  [SOT89]
U8  ESP32-P4  [QFN105-35P-500L500W]
U9  W25Q128JV  [SOIC-8-208MIL]
U10  SPX3819  [SOT23-5]
U11  TLV62569DBVR  [SOT23-5-95P-300L300W]
U12  ES8311  [QFN20-40P-300L300W55H]
U13  IP101GRI  [QFN32-40P-400W400L]
U14  SPX3819  [SOT23-5]
U15  SPX3819  [SOT23-5]
U16  SPX3819  [SOT23-5]
U17  TLV62569DBVR  [SOT23-5-95P-300L300W]
U20  NS4150B  [MSOP8-65P-490L300W110H]
UN  PAD-TEST-POINT-CIRCLE'4545'  [TP_4545]
UP  PAD-TEST-POINT-CIRCLE'4545'  [TP_4545]
USB-CDC/JTAG  USB_C5  [USB-C-16P-5]
USB-DEVICE  USB_C5  [USB-C-16P-5]
USB-NATIVE  USB_C5  [USB-C-16P-5]
USB-OTG  USB_C5  [USB-C-16P-5]
USB-TTL  USB_C5  [USB-C-16P-5]
VCOM  PAD-TEST-POINT-CIRCLE'4545'  [TP_4545]
VGH  PAD-TEST-POINT-CIRCLE'4545'  [TP_4545]
VGL  PAD-TEST-POINT-CIRCLE'4545'  [TP_4545]
VPWR  PAD-TEST-POINT-CIRCLE'4545'  [TP_4545]
X1  40MHz(10ppm)  XTAL-4-3225  [NX3225]
X2  25MHz(10ppm)  XTAL-4-3225  [NX3225]
X3  24MHz  CRYSTAL-OSCILLATOR2.5*2.0  [OSC4-SMD-2.5X2.0X0.8MM]

## Nets
3.3V: C5.1 C9.1 C16.2 C17.2 C22.1 C23.2 C24.2 C29.2 C30.2 P1.1 P3.1 R1.2 R36.2 R42.2 R44.2 R47.2 R57.2 R63.2 R66.2 R67.2 R155.1 R186.2 R187.2 R188.2 R189.2 R190.2 U1.3(3V3)
25M_XI: C117.2 U13.2(X1) X2.3(X2)
25M_XO: C116.1 U13.3(X2) X2.1(X1)
+3V3: C3.2 C18.2 C19.2 C20.1 C25.1 C27.1 C42.1 C60.2 C66.2 C159.2 J1.3 J2.3 PWR.A R22.2 R48.2 R63.1 R149.2 R151.2 R156.2 R182.2 U3.7(VCC) U3.10(V3) U5.5(VOUT) U14.1(VIN) U14.3(EN) U15.1(VIN) U15.3(EN) U16.1(VIN) X3.1(ENABLE) X3.4(VDD)
A3V3: C137.1 C139.2 FB3.2 R133.2 U10.5(VOUT)
ADCVREF: C126.2 R140.1 U12.15(ADCVREF)
AGND: C118.2 C119.2 C120.2 C121.2 C126.1 C127.1 C128.2 C131.2 C132.2 C135.2 C140.2 C141.2 C142.2 C143.2 C144.2 C146.2 C148.2 C149.1 C161.1 C162.2 C163.2 C164.2 MIC.2(GND) MIC.3(GND) R137.1 R139.2 R163.1 R164.1 U12.5(DGND) U12.10(AGND) U12.21(GND) U20.7(GND) ; supply symbol labelled GND_POWER
AVDD: C121.1 R133.1 U12.11(AVDD)
BAT: FB2.1 R141.1
C6_EN: C1.1 C6_EN.T C6_RST.3 C6_RST.4 P1.6 R66.1 R171.2 U1.8(EN)
C6_IO2: R68.1 U1.5(IO2)
C6_U0RXD: C6_U0RXD.T P1.4 U1.30(RX0/IO17)
C6_U0TXD: C6_U0TXD.T P1.3 U1.31(TX0/IO16)
CCLK: C87.2 J4.14 R142.1 R144.1
CODEC_CE: R138.2 R139.1 U12.20(CE)
COL: R119.2 R120.1 U13.4(COL/RMII)
CRS: R115.2 R116.1 U13.20(LEDMOD/CRS)
CSI_1V8: C31.1 C32.2 J4.16 R148.2 R183.2 R185.1 R197.2 R198.2 U15.5(VOUT)
CSI_2V8: C21.1 C108.2 J4.23 J4.24 U14.5(VOUT)
CSI_A_CLKN: J4.6 R104.2
CSI_A_CLKP: J4.7 R105.2
CSI_A_DATA0N: J4.9 R107.2
CSI_A_DATA0P: J4.10 R106.2
CSI_A_DATA1N: J4.3 R34.2
CSI_A_DATA1P: J4.4 R103.2
CSI_REXT: R150.1 U8.48(CSI_REXT)
CSI_RST: C88.2 CSI_RST.3 CSI_RST.4 J4.17 R46.1 R147.2 R149.1
CSI_SCL: J4.21 Q20.2(S) R183.1
CSI_SDA: J4.20 Q19.2(S) R148.1
D+: U3.1(UD+) USB-TTL.A6(D+) USB-TTL.B6(D+)
D-: U3.2(UD-) USB-TTL.A7(D-) USB-TTL.B7(D-)
DACVREF: C127.2 U12.14(DACVREF)
DSI_A_CLKN: J5.13 R98.1
DSI_A_CLKP: J5.14 R99.1
DSI_A_DATA0N: J5.7 R109.1
DSI_A_DATA0P: J5.8 R100.1
DSI_A_DATA1N: J5.10 R97.1
DSI_A_DATA1P: J5.11 R96.1
DSI_REXT: R95.1 U8.34(DSI_REXT)
DTR: Q3.2(E) R26.2 U3.4(DTR#)
EN_DCDC: R196.1 U8.79(EN_DCDC) U17.1(EN)
ESP_EN: C8.2 Q4.3(C) R16.1 RST.2 U8.103(CHIP_PU)
FB_DCDC: C151.2 R43.1 R169.2 U8.78(FB_DCDC) U17.5(FB)
FLASH_CK_A: R93.1 U9.6(CLK)
FLASH_CS_A: R89.1 R108.2 U9.1(/CS)
FLASH_D_A: R94.1 U9.5(DI(IO0))
FLASH_HD_A: R92.1 U9.7(/HOLD/RESET(IO3))
FLASH_Q_A: R90.1 U9.2(DO(IO1))
FLASH_WP_A: R91.1 U9.3(/WP(IO2))
GND: BAT1.- BAT.3 BAT.4 BAT.- BOOT.1 BOOT.3 BOOT.4 C1.2 C2.1 C3.1 C4.1 C5.2 C6.1 C6_BOOT.1 C6_BOOT.2 C6_RST.1 C6_RST.2 C7.1 C8.1 C9.2 C10.1 C11.1 C12.1 C13.1 C14.1 C15.1 C16.1 C17.1 C18.1 C19.1 C20.2 C21.2 C22.2 C23.1 C24.1 C25.2 C26.1 C27.2 C28.2 C29.1 C30.1 C31.2 C32.1 C34.2 C35.1 C36.1 C37.2 C38.2 C39.2 C40.2 C41.2 C42.2 C43.1 C44.2 C45.2 C46.1 C47.1 C50.1 C51.1 C52.1 C53.1 C54.1 C55.1 C56.1 C57.1 C58.1 C59.1 C60.1 C62.1 C63.1 C64.2 C65.2 C66.1 C67.1 C69.2 C70.1 C71.2 C72.2 C73.2 C74.2 C75.2 C76.2 C77.2 C78.2 C79.2 C80.2 C81.2 C82.2 C83.2 C84.2 C85.2 C86.2 C87.1 C88.1 C89.2 C90.2 C91.2 C92.2 C93.2 C94.2 C95.2 C96.2 C97.2 C98.2 C99.2 C100.2 C101.2 C102.2 C103.2 C104.2 C105.2 C106.2 C107.2 C108.1 C109.2 C110.2 C111.2 C112.1 C113.1 C114.2 C115.2 C116.2 C117.1 C122.2 C123.2 C133.2 C134.2 C136.2 C137.2 C138.1 C139.1 C150.1 C152.2 C153.1 C154.2 C155.2 C156.2 C157.2 C159.1 C165.2 C166.1 C168.2 C169.1 C170.2 C171.2 C172.2 C173.2 C174.2 C175.2 C176.2 C177.2 C178.2 C179.2 C180.2 C181.2 C182.2 C183.2 CSI_RST.1 CSI_RST.2 D3.A D4.2(A) D5.C D6.2(C2) D8.A J1.4 J1.SS1 J1.SS2 J2.4 J2.SS1 J2.SS2 J4.5 J4.8 J4.13 J4.15 J4.19 J4.22 J4.25 J4.26 J5.6 J5.9 J5.12 J5.15 J5.18 J5.21 J6.9 J6.10 J6.25 J6.26 J6.39 J6.40 J10.5 J10.6 J10.13 J10.14 J10.19 J10.20 J10.29 J10.30 J10.33 J10.34 M1.1 M2.1 M3.1 M4.1 M5.1 M6.1 M7.1 M8.1 M9.1 P1.2 P3.6 P3.7 P3.8 Q7.2(E) R10.1 R12.1 R13.1 R14.1 R15.1 R19.1 R24.1 R27.1 R28.2 R30.1 R31.1 R32.1 R33.1 R37.2 R38.1 R50.1 R51.1 R53.1 R58.1 R60.1 R70.1 R72.1 R73.1 R95.2 R113.1 R115.1 R117.1 R119.1 R121.1 R122.1 R131.1 R137.2 R146.1 R150.2 R159.1 R161.1 R169.1 R172.1 R173.1 R174.1 R175.1 R176.1 R177.1 R178.1 R180.1 R181.1 R191.1 R192.1 R193.1 R194.1 R195.1 RST.1 RST.3 RST.4 SD.6(VSS) SD.G1 SD.G2 SD.G3 SD.G4 SPK.3 SPK.4 U1.1(GND) U1.2(GND) U1.11(GND) U1.14(GND) U1.36(GND) U1.37(GND) U1.38(GND) U1.39(GND) U1.40(GND) U1.41(GND) U1.42(GND) U1.43(GND) U1.44(GND) U1.45(GND) U1.46(GND) U1.47(GND) U1.48(GND) U1.49.1(GND) U1.49.2(GND) U1.49.3(GND) U1.49.4(GND) U1.49.5(GND) U1.49.6(GND) U1.49.7(GND) U1.49.8(GND) U1.49.9(GND) U1.50(GND) U1.51(GND) U1.52(GND) U1.53(GND) U2.2(GND) U3.3(GND) U3.EP U4.2(GND) U5.2(GND) U6.1(TEMP) U6.3(GND) U6.9(GND) U7.1(GND) U8.105(GND) U8.106(GND) U8.107(GND) U8.108(GND) U8.109(GND) U8.110(GND) U8.111(GND) U8.112(GND) U8.113(GND) U9.4(GND) U10.2(GND) U11.2(GND) U13.33(EP) U14.2(GND) U15.2(GND) U16.2(GND) U17.2(GND) USB-CDC/JTAG.GND USB-CDC/JTAG.GND2(GND) USB-DEVICE.GND USB-DEVICE.GND2(GND) USB-NATIVE.GND USB-NATIVE.GND2(GND) USB-OTG.GND USB-OTG.GND2(GND) USB-TTL.GND USB-TTL.GND2(GND) X1.2(G2) X1.4(G1) X2.2(G2) X2.4(G1) X3.2(GND)
I2C_SCL: C134.1 P3.4 Q20.3(D) R42.1 R154.2 R182.1 U12.1(CCLK)
I2C_SDA: C133.1 P3.5 Q19.3(D) R47.1 R48.1 R153.2 U12.19(CDATA)
I2S_ASDOUT: R76.1 U12.7(ASDOUT)
I2S_DSDIN: R74.1 U12.9(DSDIN)
I2S_LRCK: C120.1 R75.1 U12.8(LRCK)
I2S_MCLK: C118.1 R78.1 U12.2(MCLK)
I2S_SCLK: C119.1 R77.1 U12.6(SCLK)
IO0: C85.1 J6.23 J6.24 Q2.P$1 U8.104(GPIO0)
IO1: C86.1 J10.21 J10.22 Q2.P$2 R142.2 U8.1(GPIO1)
IO2: J6.21 J6.22 R46.2 U8.2(GPIO2)
IO3: J1.1 J6.19 J6.20 U8.3(GPIO3)
IO4: J1.2 J10.17 J10.18 U8.4(GPIO4)
IO5: J10.15 J10.16 U8.5(GPIO5)
IO6: J6.15 J6.16 R68.2 U8.6(GPIO6)
IO7: J6.3 J6.4 R153.1 U8.7(GPIO7)
IO8: J6.5 J6.6 R154.1 U8.8(GPIO8)
IO9: R74.2 U8.10(GPIO9)
IO9/BOOT: C6_BOOT.3 C6_BOOT.4 C6_IO9.T P1.5 U1.23(IO9)
IO10: R75.2 U8.11(GPIO10)
IO11: R76.2 U8.12(GPIO11)
IO12: R77.2 U8.13(GPIO12)
IO12/USB_N: U1.17(USB_D-/IO12) UN.T
IO13: R78.2 U8.14(GPIO13)
IO13/USB_P: U1.18(USB_D+/IO13) UP.T
IO14: R79.2 U8.15(GPIO14)
IO15: R80.2 U8.16(GPIO15)
IO16: R81.2 U8.17(GPIO16)
IO17: R82.2 U8.18(GPIO17)
IO18: R83.2 U8.19(GPIO18)
IO19: R84.2 U8.20(GPIO19)
IO20: J2.1 J6.13 J6.14 U8.22(GPIO20)
IO21: J2.2 J6.11 J6.12 U8.23(GPIO21)
IO22: J10.11 J10.12 R35.1 U8.24(GPIO22)
IO23: J6.7 J6.8 R59.2 U8.25(GPIO23)
IO24: R101.1 U8.52(GPIO24)
IO25: R110.1 U8.53(GPIO25)
IO26: J6.31 J6.32 R111.1 U8.55(GPIO26)
IO27: J10.37 J10.38 R112.1 U8.56(GPIO27)
IO28: U8.57(GPIO28) U13.19(FX_HEN/CRS_DV/RXDV)
IO29: U8.58(GPIO29) U13.18(RXD0)
IO30: U8.60(GPIO30) U13.17(RXD1)
IO31: R88.1 U8.61(GPIO31) U13.22(MDC)
IO32: J10.25 J10.26 U8.63(GPIO32)
IO33: J6.29 J6.30 U8.64(GPIO33)
IO34: IO34.T U8.65(GPIO34) U13.9(TXD0)
IO35: BOOT.2 IO35.T Q3.3(C) R22.1 U8.66(GPIO35) U13.8(TXD1)
IO36: IO36.T J10.23 J10.24 R151.1 U8.68(GPIO36)
IO37: IO37.T J10.7 J10.8 R17.1 U8.69(GPIO37)
IO38: IO38.T J10.9 J10.10 R2.1 U8.70(GPIO38)
IO45: J10.39 J10.40 R71.1 U8.87(GPIO45)
IO46: J10.35 J10.36 U8.88(GPIO46)
IO47: J6.37 J6.38 U8.89(GPIO47)
IO48: J6.33 J6.34 U8.90(GPIO48)
IO49: U8.92(GPIO49) U13.5(TXEN)
IO50: U8.93(GPIO50) U13.10(TXCLK/50M_CLKI) U13.14(RXCLK/50M_CLKO)
IO51: R131.2 R132.1 U8.94(GPIO51) U13.32(RESET_N)
IO52: R87.1 U8.95(GPIO52) U13.23(MDIO)
IO53: J6.35 J6.36 R170.1 U8.97(GPIO53)
IO54: J10.31 J10.32 R171.1 U8.98(GPIO54)
LCD_AVDD: C53.2 C55.2 C61.2 D7.1(A1) D9.- J5.22 R29.2 R49.2
LCD_RST: C15.2 J5.4 R1.1
LCD_VCOM: C52.2 C112.2 C113.2 J5.1 R3.2 R29.1 VCOM.T
LCD_VDD: C26.2 C28.1 J5.2 J5.3 R157.2 R158.2 R160.2 R185.2 U16.5(VOUT)
LCD_VGH: C51.2 C56.2 C57.2 D8.C J5.28 R18.1 R24.2 VGH.T
LCD_VGL: C46.2 C58.2 C59.2 D5.A J5.27 R10.2 R11.2 VGL.T
LED+: C11.2 C12.2 C68.2 D1.- D+.T J3.1 J5.29 J5.30 U2.5(OVP)
LED-: C68.1 D-.T J3.2 J5.23 J5.24 R32.2 R33.2 U2.3(FB)
MICN: C130.2 MK1.2 R162.1 R163.2
MICP: C129.2 C160.2 MK1.1 R152.1
MKF_3V1: C107.1 C109.1 U13.28(REGOUT)
MKF_3V3: C71.1 C72.1 C73.1 C89.1 C90.1 C92.1 C99.1 C105.1 C106.1 C158.2 C161.2 C164.1 C167.1 C168.1 C169.2 FB1.2 FB4.1 J6.1 J6.2 J6.17 J6.18 L4.P$2 MIC.1(VDD) Q1.2(S) R41.1 R69.2 R102.1 R136.1 R138.1 R145.2 R155.2 U8.9(VDD_LP) U8.21(VDD_IO_0) U8.62(VDD_IO_4) U8.75(VDD_LDO) U8.77(VDD_DCDCC) U8.96(VDD_IO_6) U8.101(VDD_ANA)
MKF_LDO_VO1: C93.1 R56.1 U8.71(VDDO_FLASH)
MKF_LDO_VO2: C94.1 C97.1 C98.1 U8.59(VDD_PSRAM_0) U8.67(VDD_PSRAM_1) U8.72(VDDO_PSRAM)
MKF_LDO_VO3: C78.1 C79.1 C95.1 C101.1 U8.41(VDD_MIPI_DPHY) U8.73(VDDO_3)
MKF_LDO_VO4: C54.2 C96.1 C102.1 C103.1 R4.2 R5.2 R6.2 R7.2 R8.2 R9.2 U8.74(VDDO_4) U8.85(VDD_IO_5)
MKF_VBAT: C83.1 C84.1 FB2.2 FB4.2 R16.2 U8.102(VDD_BAT)
MKF_VDD_HP: C74.1 C75.1 C91.1 C104.1 C151.1 C152.1 C153.2 L3.P$2 R43.2 U8.26(VDD_HP_0) U8.76(VDD_HP_2) U8.91(VDD_HP_3)
N$1: C47.2 D6.1(A1) R11.1
N$2: Q4.1(B) R26.1
N$3: Q3.1(B) R25.1
N$4: C61.1 R49.1 R50.2 R52.1
N$5: R38.2 USB-CDC/JTAG.A5(CC1)
N$6: R15.2 USB-NATIVE.A5(CC1)
N$7: PWR.C R19.2
N$8: C48.2 D6.3(COM)
N$9: C48.1 C49.2 D9.+ L2.P$2 U4.1(SW)
N$10: R13.2 USB-TTL.A5(CC1)
N$11: R12.2 USB-TTL.B5(CC2)
N$12: C49.1 D7.3(COM)
N$13: C50.2 D7.2(C2) R18.2
N$14: R14.2 USB-NATIVE.B5(CC2)
N$15: R52.2 U4.3(FB)
N$16: R3.1 R30.2
N$17: D1.+ L1.P$2 R23.2 U2.1(LX)
N$18: R27.2 USB-CDC/JTAG.B5(CC2)
N$19: R64.1 U4.4(EN)
N$20: R53.2 USB-OTG.A5(CC1)
N$21: C34.1 C150.2 R41.2 R196.2 U17.4(VIN)
N$22: C2.2 R23.1
N$23: L3.P$1 U17.3(SW)
N$24: Q7.3(C) R31.2 R39.1 U2.4(EN)
N$25: R51.2 USB-OTG.B5(CC2)
N$26: Q22.1(B) Q22.3(C) Q23.1(B) R191.2
N$27: Q21.1(G) Q23.3(C) R192.2
N$28: R67.1 U1.22(IO8)
N$29: Q7.1(B) R59.1 R60.2
N$30: R28.1 U6.2(ISET)
N$31: R61.2 U6.7(CHRG)
N$32: R62.2 U6.6(DONE)
N$33: CHRG.C R61.1
N$34: DONE.C R62.1
N$35: R73.2 USB-DEVICE.A5(CC1)
N$36: C158.1 Q1.1(G) R69.1 R70.2 R71.2
N$37: R72.2 USB-DEVICE.B5(CC2)
N$38: R144.2 X3.3(OUT)
N$39: R156.1 U16.3(EN)
N$40: BAT1.+$1(+) BAT1.+$2(+1) R141.2
N$41: C160.1 C163.1 L5.2
N$42: C130.1 U12.17(MIC1N)
N$43: C162.1 L5.1 MIC.4(OUT)
N$44: C167.2 R145.1 R146.2 U11.5(FB)
N$45: C122.1 C125.1 U12.12(OUTP)
N$46: R17.2 U3.9(RXD)
N$47: C123.1 C124.1 U12.13(OUTN)
N$48: C124.2 R134.1
N$49: R2.2 U3.8(TXD)
N$50: C125.2 R135.1
N$51: C129.1 U12.18(MIC1P)
N$52: C131.1 C132.1 R136.2 U12.3(PVDD) U12.4(DVDD)
N$53: C135.1 R140.2 R152.2 R162.2
N$54: C140.1 U20.2(BYPASS)
N$55: C141.1 C142.1 C143.1 FB5.1 U20.6(VCC)
N$56: C145.2 R165.1
N$57: C147.2 R166.1
N$58: C33.2 C149.2 R168.2 SPK.2
N$59: C33.1 C148.1 R167.2 SPK.1
N$60: R143.1 U11.1(EN)
N$61: Q11.1(B) Q11.3(C) Q12.1(B) R174.2
N$62: L4.P$1 U11.3(SW)
N$63: R89.2 U8.27(FLASH_CS)
N$64: R90.2 U8.28(FLASH_Q)
N$65: R91.2 U8.29(FLASH_WP)
N$66: Q8.1(B) Q8.3(C) Q9.1(B) R172.2
N$67: R92.2 U8.31(FLASH_HOLD)
N$68: R93.2 U8.32(FLASH_CK)
N$69: R94.2 U8.33(FLASH_D)
N$70: C154.1 J7.6(CT2)
N$71: R96.2 U8.35(DSI_DATAP1)
N$72: R97.2 U8.36(DSI_DATAN1)
N$73: R98.2 U8.37(DSI_CLKN)
N$74: R99.2 U8.38(DSI_CLKP)
N$75: R100.2 U8.39(DSI_DATAP0)
N$76: C45.1 U5.4(BYP)
N$77: C155.1 J7.5(CT1)
N$78: C80.1 C81.1 C82.1 R102.2 U8.51(VDD_USBPHY)
N$79: C156.1 J7.10(CGND)
N$80: C157.1 J7.13 J7.14
N$81: J7.11(LED-) R178.2
N$82: R103.1 U8.47(CSI_DATAP1)
N$83: R34.1 U8.46(CSI_DATAN1)
N$84: R104.1 U8.45(CSI_CLKN)
N$85: R105.1 U8.44(CSI_CLKP)
N$86: R106.1 U8.43(CSI_DATAP0)
N$87: R107.1 U8.42(CSI_DATAN0)
N$88: R109.2 U8.40(DSI_DATAN0)
N$89: J7.2(LED1-) R179.1
N$90: Q5.1(G) Q9.3(C) R173.2
N$91: Q10.1(G) Q12.3(C) R175.2
N$92: Q14.1(B) Q14.3(C) Q15.1(B) R176.2
N$93: Q13.1(G) Q15.3(C) R177.2
N$94: Q17.1(B) Q17.3(C) Q18.1(B) R180.2
N$95: Q16.1(G) Q18.3(C) R181.2
N$96: 3V3.T C62.2 C63.2 L2.P$1 R64.2 R184.2 U4.5(VIN)
N$97: Q25.1(B) Q25.3(C) Q26.1(B) R193.2
N$98: Q24.1(G) Q26.3(C) R194.2
N$100: Q6.1(G) Q28.3(C) R195.2
N$101: Q20.1(G) R198.1
N$102: R124.1 U8.80(GPIO39)
N$103: R125.1 U8.81(GPIO40)
N$104: R126.1 U8.82(GPIO41)
N$105: R127.1 U8.83(GPIO42)
N$106: R128.1 U8.84(GPIO43)
N$107: Q19.1(G) R197.1
N$108: R129.1 U8.86(GPIO44)
N$110: Q27.1(B) Q27.3(C) Q28.1(B) R58.2
OUTN: C146.1 C147.1 R134.2
OUTP: C144.1 C145.1 R135.2
PA_CTRL: R164.2 R170.2 U20.1(CTRL)
PA_INL+: R165.2 U20.3(IN+)
PA_INL-: R166.2 U20.4(IN-)
PA_OUTL+: R167.1 U20.8(OUT+)
PA_OUTL-: R168.1 U20.5(OUT-)
PHY_3V3: C110.1 C111.1 C114.1 C115.1 FB1.1 J7.1(LED1+) R87.2 R88.2 R114.2 R116.2 R118.2 R120.2 R123.2 R130.2 R132.2 U13.13(VDD_IO) U13.31(AVDD33)
PHY_AD0: R123.1 R179.2 U13.11(LED0/PHY_AD0)
PHY_AD3: J7.12(LED+) R122.2 U13.12(LED3/PHY_AD3)
PHY_ISET: R121.2 U13.25(ISET)
PHY_TESTON: R130.1 U13.24(TEST_ON)
RD+: J7.7(RD+) U13.27(MDI_RP)
RD-: J7.8(RD-) U13.26(MDI_RN)
RESET: R147.1
RTS: Q4.2(E) R25.2 U3.6(RTS#)
RXER: R117.2 R118.1 U13.21(INTR_32/RXER)
SD1_CLK: D4.5(C4) R5.1 R128.2 SD.5(SCLK)
SD1_CMD: D4.3(C2) R4.1 R129.2 SD.3(DI)
SD1_D0: D4.6(C5) R6.1 R124.2 SD.7(DO)
SD1_D1: R9.1 R125.2 SD.8(DATA1)
SD1_D2: D4.1(C1) R7.1 R126.2 SD.1(DATA2)
SD1_D3: R8.1 R127.2 SD.2(CS)
SD1_VDD: C10.2 C14.2 D4.4(C3) Q1.3(D) R55.1 SD.4(VDD)
SD2_CLK: R83.1 R186.1 U1.25(SDIO_CLK/IO19)
SD2_CMD: R57.1 R84.1 U1.24(SDIO_CMD/IO18)
SD2_D0: R79.1 R187.1 U1.26(SDIO_D0/IO20)
SD2_D1: R80.1 R188.1 U1.27(SDIO_D1/IO21)
SD2_D2: R81.1 R189.1 U1.28(SDIO_D2/IO22)
SD2_D3: R82.1 R190.1 U1.29(SDIO_D3/IO23)
SD_DET: R55.2 SD.9(CDN)
SHLR: J5.25 R159.2 R160.1
STBYB: J5.5 R157.1
TD+: J7.3(TD+) U13.30(MDI_TP)
TD-: J7.4(TD-) U13.29(MDI_TN)
TP_INT: P3.2 R36.1 R37.1
TP_RST: C13.2 P3.3 R35.2 R44.1
TXER: R113.2 R114.1 U13.1(TXER/FXSD)
UPDN: J5.26 R158.1 R161.2
USB1_5V: C170.1 C171.1 Q5.3(D) Q8.2(E) USB-NATIVE.VBUS1(VBUS) USB-NATIVE.VBUS2(VBUS)
USB1_D+: R20.1 USB-NATIVE.A6(D+) USB-NATIVE.B6(D+)
USB1_D-: R21.1 USB-NATIVE.A7(D-) USB-NATIVE.B7(D-)
USB1P1_N: R45.2 R101.2
USB1P1_N_2: R65.2 R111.2
USB1P1_P: R40.2 R110.2
USB1P1_P_2: R54.2 R112.2
USB2_5V: C172.1 C173.1 Q10.3(D) Q11.2(E) USB-CDC/JTAG.VBUS1(VBUS) USB-CDC/JTAG.VBUS2(VBUS)
USB2_D+: R40.1 USB-CDC/JTAG.A6(D+) USB-CDC/JTAG.B6(D+)
USB2_D-: R45.1 USB-CDC/JTAG.A7(D-) USB-CDC/JTAG.B7(D-)
USB3_5V: C174.1 C175.1 Q13.3(D) Q14.2(E) USB-OTG.VBUS1(VBUS) USB-OTG.VBUS2(VBUS)
USB3_D+: R54.1 USB-OTG.A6(D+) USB-OTG.B6(D+)
USB3_D-: R65.1 USB-OTG.A7(D-) USB-OTG.B7(D-)
USB4_5V: D12.C Q6.2(S) Q28.2(E) USB-DEVICE.VBUS1(VBUS) USB-DEVICE.VBUS2(VBUS)
USB4_D+: R85.1 USB-DEVICE.A6(D+) USB-DEVICE.B6(D+)
USB4_D-: R86.1 USB-DEVICE.A7(D-) USB-DEVICE.B7(D-)
USB_5V: C36.2 C37.1 C38.1 C39.1 C178.1 C179.1 CHRG.A DONE.A Q5.2(S) Q9.2(E) Q10.2(S) Q12.2(E) Q13.2(S) Q15.2(E) Q16.2(S) Q18.2(E) Q21.3(D) Q22.2(E) U6.4(VIN) U6.8(CE)
USB_DM: R21.2 R86.2 U8.49(DM)
USB_DP: R20.2 R85.2 U8.50(DP)
VBAT: BAT.+ C40.1 C44.1 C180.1 C181.1 Q24.3(D) Q25.2(E) U6.5(BAT)
VBUS: C4.2 C6.2 C7.2 C176.1 C177.1 Q16.3(D) Q17.2(E) USB-TTL.VBUS1(VBUS) USB-TTL.VBUS2(VBUS)
VCC_5V: C41.1 C43.2 C64.1 C67.2 C136.1 C138.2 C165.1 C166.2 C182.1 C183.1 D12.A FB5.2 J10.1 J10.2 J10.3 J10.4 L1.P$1 PWR1.3 PWR1.3@1 Q6.3(D) Q27.2(E) R39.2 R143.2 R184.1 U2.6(IN) U5.1(VIN) U5.3(EN) U7.3(IN) U10.1(VIN) U10.3(EN) U11.4(VIN) VPWR.T
VDD: C65.1 FB3.1 U7.2(OUT) U7.4(OUT)
VDD_FLASH: C76.1 C77.1 C100.1 R56.2 R108.1 U8.30(VDD_FLASHIO) U9.8(VCC)
VMID: C128.1 U12.16(VMID)
VPP: C35.2 D3.C PWR1.2 PWR1.2@1 Q21.2(S) Q23.2(E) Q24.2(S) Q26.2(E)
XTAL_N: C70.2 U8.99(XTAL_N) X1.3(X2)
XTAL_P: C69.1 U8.100(XTAL_P) X1.1(X1)
Unconnected: J4.1 J4.2 J4.11 J4.12 J4.18 J5.16 J5.17 J5.19 J5.20 J6.27 J6.28 J7.9(NC) J10.27 J10.28 PWR1.1 PWR1.1@1 U1.6(IO3) U1.9(MTMS/LP_RX/IO4) U1.10(MTDI/LP_TX/IO5) U1.12(XTAL_32K_P/IO0) U1.13(XTAL_32K_N/IO1) U1.15(MTCK/LP_SDA/IO6) U1.16(MTDO/LP_SCL/IO7) U1.19(IO14) U1.20(IO15) U3.5(CTS#) U8.54(NC) U10.4(BYP) U13.6(TXD3) U13.7(TXD2) U13.15(RXD3) U13.16(RXD2) U14.4(BYP) U15.4(BYP) U16.4(BYP) USB-CDC/JTAG.SHLD1(SHLD) USB-CDC/JTAG.SHLD2(SHLD) USB-CDC/JTAG.SHLD3(SHLD) USB-CDC/JTAG.SHLD4(SHLD) USB-CDC/JTAG.SHLD5(SHLD) USB-CDC/JTAG.SHLD6(SHLD) USB-CDC/JTAG.SHLD7(SHLD) USB-CDC/JTAG.SHLD8(SHLD) USB-DEVICE.SHLD1(SHLD) USB-DEVICE.SHLD2(SHLD) USB-DEVICE.SHLD3(SHLD) USB-DEVICE.SHLD4(SHLD) USB-DEVICE.SHLD5(SHLD) USB-DEVICE.SHLD6(SHLD) USB-DEVICE.SHLD7(SHLD) USB-DEVICE.SHLD8(SHLD) USB-NATIVE.SHLD1(SHLD) USB-NATIVE.SHLD2(SHLD) USB-NATIVE.SHLD3(SHLD) USB-NATIVE.SHLD4(SHLD) USB-NATIVE.SHLD5(SHLD) USB-NATIVE.SHLD6(SHLD) USB-NATIVE.SHLD7(SHLD) USB-NATIVE.SHLD8(SHLD) USB-OTG.SHLD1(SHLD) USB-OTG.SHLD2(SHLD) USB-OTG.SHLD3(SHLD) USB-OTG.SHLD4(SHLD) USB-OTG.SHLD5(SHLD) USB-OTG.SHLD6(SHLD) USB-OTG.SHLD7(SHLD) USB-OTG.SHLD8(SHLD) USB-TTL.SHLD1(SHLD) USB-TTL.SHLD2(SHLD) USB-TTL.SHLD3(SHLD) USB-TTL.SHLD4(SHLD) USB-TTL.SHLD5(SHLD) USB-TTL.SHLD6(SHLD) USB-TTL.SHLD7(SHLD) USB-TTL.SHLD8(SHLD)

## Notes on the sheet
- Mic&Speak
- MCU
- 1.2V
- 0.6V
- 0x18
- CR1220
- 1V1~1V3
- ME6217
- key flash
- Camera
- Camera
- NC
- D1N
- D1P
- GND
- CKN
- CKP
- WiFi
- GND
- D0N
- D0P
- NC
- NC
- GND
- MCLK
- GND
- ESP32-C6
- 1.8V
- RST
- NC
- GND
- VDD Range:
  3.0V - 3.6V
- SDA
- SCL
- LCD | GND
- 2.8V | wake up
- 18V
- -6V | BAT54S | 2.8V
- ME6217
- Level Shifter
- 9.55V
- 9.6V | 3.15V
- 0.6V
- ME6217
- 1.8V
- POWER | USB to UART
- 18.9V | Ethernet
- 16.2V | USB TO SERIAL CONVERTER
- ME6217
- LEDS
- -7.3V
- 20V | ME6217
- 10.93V | -7V
- 9.6V
- POWER AND FILTERING
- MIPI_DP3
- MIPI_DN3 | USB
- MIPI_DP2
- MIPI_DN2
- MIPI_CP
- MIPI_CN
- MIPI_DP1
- USB2.0 High Speed
- MIPI_DN1
- USB | USB Type C
- MIPI_DP0 | USB
- MIPI_DN0
- STBYB
- LRSTB
- VDD | 1.8V
- VDD
- VCOM | 3.7V
- Backlight:180mA
- USB Type C
- USB Type C
- USB2.0 Full-Speed
- USB
- 2.5~5.5V
- USB
- HC632701A-M906-A
- Mabee
- Closer to IC
- USB Type C
- Back Light
- USB Type C
- Closer to IC
- Switch
- Touch
- MaTouch ESP32-P4 TFT with Touch 7" V1.2
- www.makerfabs.com
- Design by Charlin
- GT911
- GT911
- TF Card
- SDIO 3.0
- Zener
- LDO&Charger
- D3
- CMD
- CLK
- D0

## Library data of the parts
3V3 C6_EN C6_IO9 C6_U0RXD C6_U0TXD UN UP VCOM VGH VGL VPWR = Discrete:PAD-TEST-POINT-CIRCLE; PARTNO: DNP
BAT = Connector-new:JST-2P-SMD: 2P-SMD-1.0-90D:320110054;2P-SMD-2.0-90D:320110026
BAT1 = adafruit:CR1220: CR1216/CR1220/CR1225 12mm 3V lithium coin cell Great for battery packup. Both SMT and THM holders. Note the THM package has the ground pads on both sides of the PCB so that the masks are the same - this reduces the cost
BOOT RST = sale:TS24CA
C1 C5 C9 C20-C22 C25 C27 C28 C31 C33-C45 C64 C65 C67 C71-C84 C89-C107 C109-C111 C114 C115 C118-C157 C165-C183 = Discrete:C*: Ceramic Capacitors
C2-C4 C6-C8 C10-C19 C23 C24 C26 C29 C30 C32 C46-C63 C66 C68-C70 C85-C88 C108 C112 C113 C116 C117 C158 = A9G:DISCRETE_C*: Ceramic Capacitors
C6_BOOT C6_RST CSI_RST = SparkFun-Switches:MOMENTARY-SWITCH-SPST: Momentary Switch (Pushbutton) - SPST Normally-open (NO) SPST momentary switches (buttons, pushbuttons). Variants PTH-12MM - 12mm square, through-hole Momentary Pushbutton Switch - 12mm Square <https://www.sparkfun.com/products/9190> (COM-09190) PTH-6.0MM, PTH-6.0MM-KIT - 6.0mm square, through-hole Mini Pushbutton Switch <https://www.sparkfun.com/products/97> (COM-00097) KIT package intended for soldering kit's - only one side of pads' copper is exposed. PTH-RIGHT-ANGLE-KIT - Right-angle, through-hole Right Angle Tactile Button <https://www.sparkfun.com/products/10791> - Used on SparkFun BigTime Watch Kit <https://www.sparkfun.com/products/11734> SMD-12MM - 12mm square, surface-mount Tactile Button - SMD (12mm) <https://www.sparkfun.com/products/12993> (COM-12993) Used on SparkFun PicoBoard <https://www.sparkfun.com/products/11888> SMD-4.5MM - 4.5mm Square Trackball Switch Used on SparkFun Blackberry Trackballer Breakout <https://www.sparkfun.com/products/13169> SMD-4.6MMX2.8MM - 4.60mm x 2.80mm, surface mount Used on SparkFun Pro Micro - RP2040 <https://www.sparkfun.com/products/17717> SMD-5.2MM, SMD-5.2-REDUNDANT - 5.2mm square, surface-mount Mini Pushbutton Switch - SMD <https://www.sparkfun.com/products/8720> (COM-08720) Used on Arduino Pro Mini <https://www.sparkfun.com/products/11114> REDUNDANT package connects both switch circuits together SMD-6.0X3.5MM - 6.0 x 3.5mm, surface mount Momentary Reset Switch SMD <https://www.sparkfun.com/products/8229> (COM-08229) SMD-6.2MM-TALL - 6.2mm square, surface mount Tactile Button - SMD (6mm) <https://www.sparkfun.com/products/12992> Used on SparkFun Digital Sandbox <https://www.sparkfun.com/products/12651> SMD-RIGHT-ANGLE - Right-angle, surface mount Used on SparkFun Block for Intel® Edison - Arduino <https://www.sparkfun.com/products/13036>; PROD_ID: SWCH-15606
C159-C164 = Discrete-new:CAP: Ceramic Capacitors
CHRG DONE PWR = microbuilder:LED: LED 0603 - 0603 Surface Mount Package 2mA: Green LED - Low Power (3.9mcd, 2ma, 1.7Vf) - Digikey: 475-2709-2-ND Orange LED - Low Power (9.8mcd, 2ma, 1.8Vf) - Digikey: 475-1194-2-ND Red LED - Low Power (5mcd, 2ma, 1.8Vf) - Digikey: 475-1195-2-ND Yellow LED - Low Power (7mcd, 2ma, 1.8Vf) - Digikey: 475-1196-2-ND 5mA: Blue LED - Low Power (17mcd, 5ma, 2.9Vf) - Digikey: LNJ937W8CRACT-ND 0805 - 0805 Surface Mount Package 2mA: Red LED (8.8mcd, 2mA, 1.8Vf, Clear) - Low Power [Digikey: 475-2510-1-ND] Green LED (5mcd, 2mA, 1.8Vf, Clear) - Low Power [Digikey: 475-2730-1-ND] Yellow LED (11.3mcd, 2mA, 1.8Vf, Clear) - Low Power [Digikey: 475-2555-1-ND] 20mA: Red LED (104mcd, 20mA, Diffused) - LS R976 [Digikey: 475-1278-6-ND] Red LED (12mcd, 20mA, 2.0Vf, Clear) - APT2012EC [Digikey: 754-1128-1-ND] Green LED (15mcd, 20mA, 2.2Vf, Clear) - APT2012GC [Digikey: 754-1131-1-ND] Orange LED (160mcd, 20mA, 2.1Vf, Clear) - APT2012SECK [Digikey: 754-1130-1-ND] 1206 - 1206 Surface Mount Package Green LED (26mcd, 20mA, Diffused) - LG N971 [Digikey: 475-1407-6-ND] Red LED (15mcd, 20mA, Diffused) - LH N974 [Digikey: 475-1416-6-ND] Cree - Cree High-Power Surface Mount LEDs XPEBWT-L1-0000-00D50 - White 111lm 350mA 2.9Vf 6200K 110° XTEAWT-00-0000-00000LEE3 - White 114lm 350mA 2.85Vf 5000K 115° Everlight - Everlight 45-21 Series Surface Mount LEDs 45-21/QK2C-B2832AC2CB2/2T - Warm White 2000mcd 20mA 3.25Vf 3050K 120° 45-21/LK2C-B38452C4CB2/2T - Nuetral White 2000mcd 20mA 3.25Vf 4150K 120° 45-21/LK2C-B50634C6CB2/2T - Cold White 2200mcd 20mA 3.25Vf 5650K 120° PLCC2 Reverse Mount LS T77K-J1L2-1-0-2-R18-Z - Red 11.25mcd 2mA 1.8Vf 630nm 120° LO T77K-L1M2-24-Z - Orange 19.6mcd 2mA 1.8Vf 606nm 120° LY T77K-K2M1-26-Z - Yellow 15.7mcd 2mA 1.8Vf 587nm 120°
D1 D9 = Discrete:D*
D3 D12 = diode:DIODE-: DIODE
D4 = microbuilder:TVSARRAY_5LANE: Voltage Transient Suppressor Array SOT363 SMF05C - 100W 5V: Digikey - SMF05CT1GOSCT-ND
D5 D8 = SparkFun-DiscreteSemi:DIODE-ZENER: Zener Diode A Zener diode allows current to flow from its anode to its cathode like a normal semiconductor diode, but it also permits current to flow in the reverse direction when its "Zener voltage" is reached. - WIkipedia; PROD_ID: DIO-12442; VALUE: 5.6V
D6 D7 = SparkFun-DiscreteSemi:BAV99: Series-pair diode array Two small signal silicon diodes connected anode to cathode. Connections to all three nodes available. Link to datasheet <https://www.fairchildsemi.com/datasheets/BA/BAV99.pdf> SparkFun Products: SparkFun AutoDriver <https://www.sparkfun.com/products/13752>; PROD_ID: DIO-10647
D+ D- IO34-IO38 = Discrete-new:TEST-POINT; PARTNO: DNP
FB1-FB5 = SparkFun-Coils:INDUCTOR: Inductors Resist changes in electrical current. Basically a coil of wire. SparkFun Products: SparkFun Load Cell Amplifier - HX711 <https://www.sparkfun.com/products/13879> IOIO-OTG - V2.2 <https://www.sparkfun.com/products/13613>; PROD_ID: NDUC-07859
J1 J2 = Connector-new:GROVE-CONNECTOR-SMD: 4P-SMD-2.0:320110030;4P-SMD-2.0-90D:320110032
J3 = Connector:XH2.54-2P
J4 = self:FPC-24P
J5 = Connector:FPC-SOCKET-0.5-30P
J6 J10 = user:CON2X20-254P-A
J7 = user:HR961160C
L1-L4 = SparkFun-Coils:INDUCTOR: Inductors Resist changes in electrical current. Basically a coil of wire. SparkFun Products: SparkFun Load Cell Amplifier - HX711 <https://www.sparkfun.com/products/13879> IOIO-OTG - V2.2 <https://www.sparkfun.com/products/13613>; PROD_ID: NDUC-11157; VALUE: 3.3µH/±30%/3.4A
L5 = Discrete-new:INDUCTOR/FERRITE-BEAD
M1-M9 = sale:M2.5
MIC = Connector-new:MIC-MSM421A3729H8-C
MK1 = SparkFun-Retired:MIC: Microphone Omni-directional electret microphones - one through-hole, the other SMD. Datasheet <http://cdn.sparkfun.com/datasheets/Sensors/Sound/CEM-C9745JAD462P2.54R.pdf> (through-hole mic) Datasheet <http://www.challengeelectronics.com/downloads/microphones/omni_directional/CEM-OB6018-3EAD443C43MR.pdf> (SMD mic) SparkFun Products PTH Electret Microphone <https://www.sparkfun.com/products/8635> (COM-08635) SparkFun Electret Microphone Breakout <https://www.sparkfun.com/products/9964> (BOB-09964) Digital Sandbox <https://www.sparkfun.com/products/12651> (DEV-12651) SparkFun Sound Detector <https://www.sparkfun.com/products/12642> (SEN-12642) SMD Microphone SparkFun Voice Recorder Breakout - ISD1932 <https://www.sparkfun.com/products/retired/10653> (BOB-10653); PROD_ID: COMP-08856; SF_ID: COM-08635
P1 = Makerfabs-Peter:DEBUG*6
P3 = sale:1X6P-1MM
PWR1 = sale:JS102011JAQN
Q1 Q5 Q6 Q10 Q13 Q16 Q21 Q24 = User-Submitted:MOSFET-PCHANNEL: Generic PMOSFET IRLML2244 - TRANS-11153 (SOT-23 -20V -4.3A) (1.Gate 2.Source 3.Drain) FQP27P06 - COM-10349 <http://www.sparkfun.com/products/10349> (TO-220 -60V -27A) (1.Gate 2.Source 3.Drain); PROD_ID: TRANS-08285
Q2 = microbuilder:CRYSTAL: Crystals HC49UP - Surface Mount Crystal 4.0MHz 18pF +/-30ppm Surface Mount Crystal [Digikey: 535-9857-1-ND] 12.0 MHz Surface Mount Crystal [Digikey: 535-9869-6-ND] 25.0 MHz Surface Mount Crystal [Digikey: 535-9078-1-ND] 2.5 x 2.0mm - MEMs SMT Crystal 16.0 MHz 10pF 20ppm 2.5 x 2.0mm Crystal [Digikey -40-85°C: 535-10923-1-ND] 3.2 x 2.5mm - MEMs SMT Crystal 12.0 MHz 8pF 15ppm 3.2 x 2.5mm Crystal [Digikey: -10-70°C: 644-1047-1-ND -40-125°C: 644-1128-1-ND] 40~85°C cheaper: 644-1173-6-ND 16.0 MHz 8pF 15ppm 3.2 x 2.5mm Crystal [Digikey: -10-70°C: 644-1049-1-ND -40-125°C: 644-1129-2-ND]-40~85°C cheaper: 644-1175-6-ND 16.0 MHz 10pF 10ppm 3.2 x 2.5mm Crystal [Digikey: 644-1100-1-ND] 27.12 MHz 18pF 30ppm 3.2 x 2.5mm Crystal [Digikey: 887-1424-1-ND] 27.12MHz 10pF 10ppm 3.2 x 2.5mm Crystal [Digikey: 887-1329-1-ND] 4.9 x 1.8mm - MEMs SMT Crystal 32.768 KHz 12.5pF 20ppm 4.9 x 1.8mm Crystal [Digikey: SE2415CT-ND] 8.0 x 3.8mm - Surface Mount Crystal 32.768kHz 12.5pF 20ppm -40°C-85°C [Digikey: 535-9166-2-ND] Cylinder 32.768KHz Cylinder Crystal (2x6mm body) [Ex. Digikey: 300-8341-2-ND]
Q3 Q4 Q7 = Discrete:TRANSISTOR-NPN*: NPN audion
Q8 Q9 Q11 Q12 Q14 Q15 Q17 Q18 Q22 Q23 Q25-Q28 = SparkFun-DiscreteSemi:TRANS_PNP: PNP transistor Current controlled devices typically used to amplify current or used as a switch. SparkFun Products: SparkFun Serial Enabled 16x2 LCD - Red on Black <https://www.sparkfun.com/products/9068> SparkFun Logomatic <https://www.sparkfun.com/products/12772>; PROD_ID: TRANS-09245
Q19 Q20 = Discrete:MOSFET-N: IRLL014: http://www.vishay.com/docs/91319/sihll014.pdf
R1 R3-R15 R18 R19 R23 R24 R27 R29-R33 R36-R39 R42 R44 R47 R49-R53 R55 R57-R60 R64 R69 R70 R72 R73 R108 R149 R156-R161 R172-R177 R180 R181 R186-R195 = A9G:DISCRETE_R*
R2 R16 R17 R20-R22 R25 R26 R28 R34 R35 R40 R41 R43 R45 R46 R48 R54 R56 R61-R63 R65-R68 R71 R74-R107 R109-R148 R150-R155 R162-R171 R178 R179 R182-R185 R196-R198 = Discrete:R*
SD = Connector:HOLDER-MICROSD-9P
SPK = sale:1X2P
U1 = ESP32-C6-MINI-1:ESP32-C6-MINI-1; PROD_ID: IC-19033
U2 = sale:RY3730
U3 = sale:CH340K
U4 = sale:SGM6601YTN5G/TR
U5 U10 U14-U16 = IC:SPX3819
U6 = self:TP4056
U7 = IC:LD1117: Low Drop Fixed And Adjustable Positive Voltage Regulators http://www.datasheetcatalog.org/datasheet/SGSThomsonMicroelectronics/mXuqtqv.pdf
U8 = user:ESP32-P4
U9 = self:W25Q128JV
U11 U17 = user:TLV62569DBVR
U12 = user:ES8311
U13 = user:IP101GRI
U20 = user:NS4150B
USB-CDC/JTAG USB-DEVICE USB-NATIVE USB-OTG USB-TTL = USBC:USB_C: USB Type C 16Pin Connector Super Speed pins not available on the 16-pin purely SMD connector so this part is best for USB 2.0 implementations. D1 and D2 are tied together enabling D+/- no matter which way the cable is plugged into the connector. The two channel configuration pins (CC1/2) are exposed. These are normally connected to ground via 5.1k resistors but can be reconfigured for high current/high power applications.
X1 X2 = adafruit:XTAL-4: Classic 4-pin 3.2 x 2.5mm crystal
X3 = Discrete-new:CRYSTAL-OSCILLATOR

## Net classes
0 default: width 0.152 mm, drill 0.305 mm, clearance 0.152 mm
1 vbat: drill 0.305 mm